# EAGLE design sound (EAGLE 9.5.2)

## Sheet 1 of 8: Interface, Address Decoding
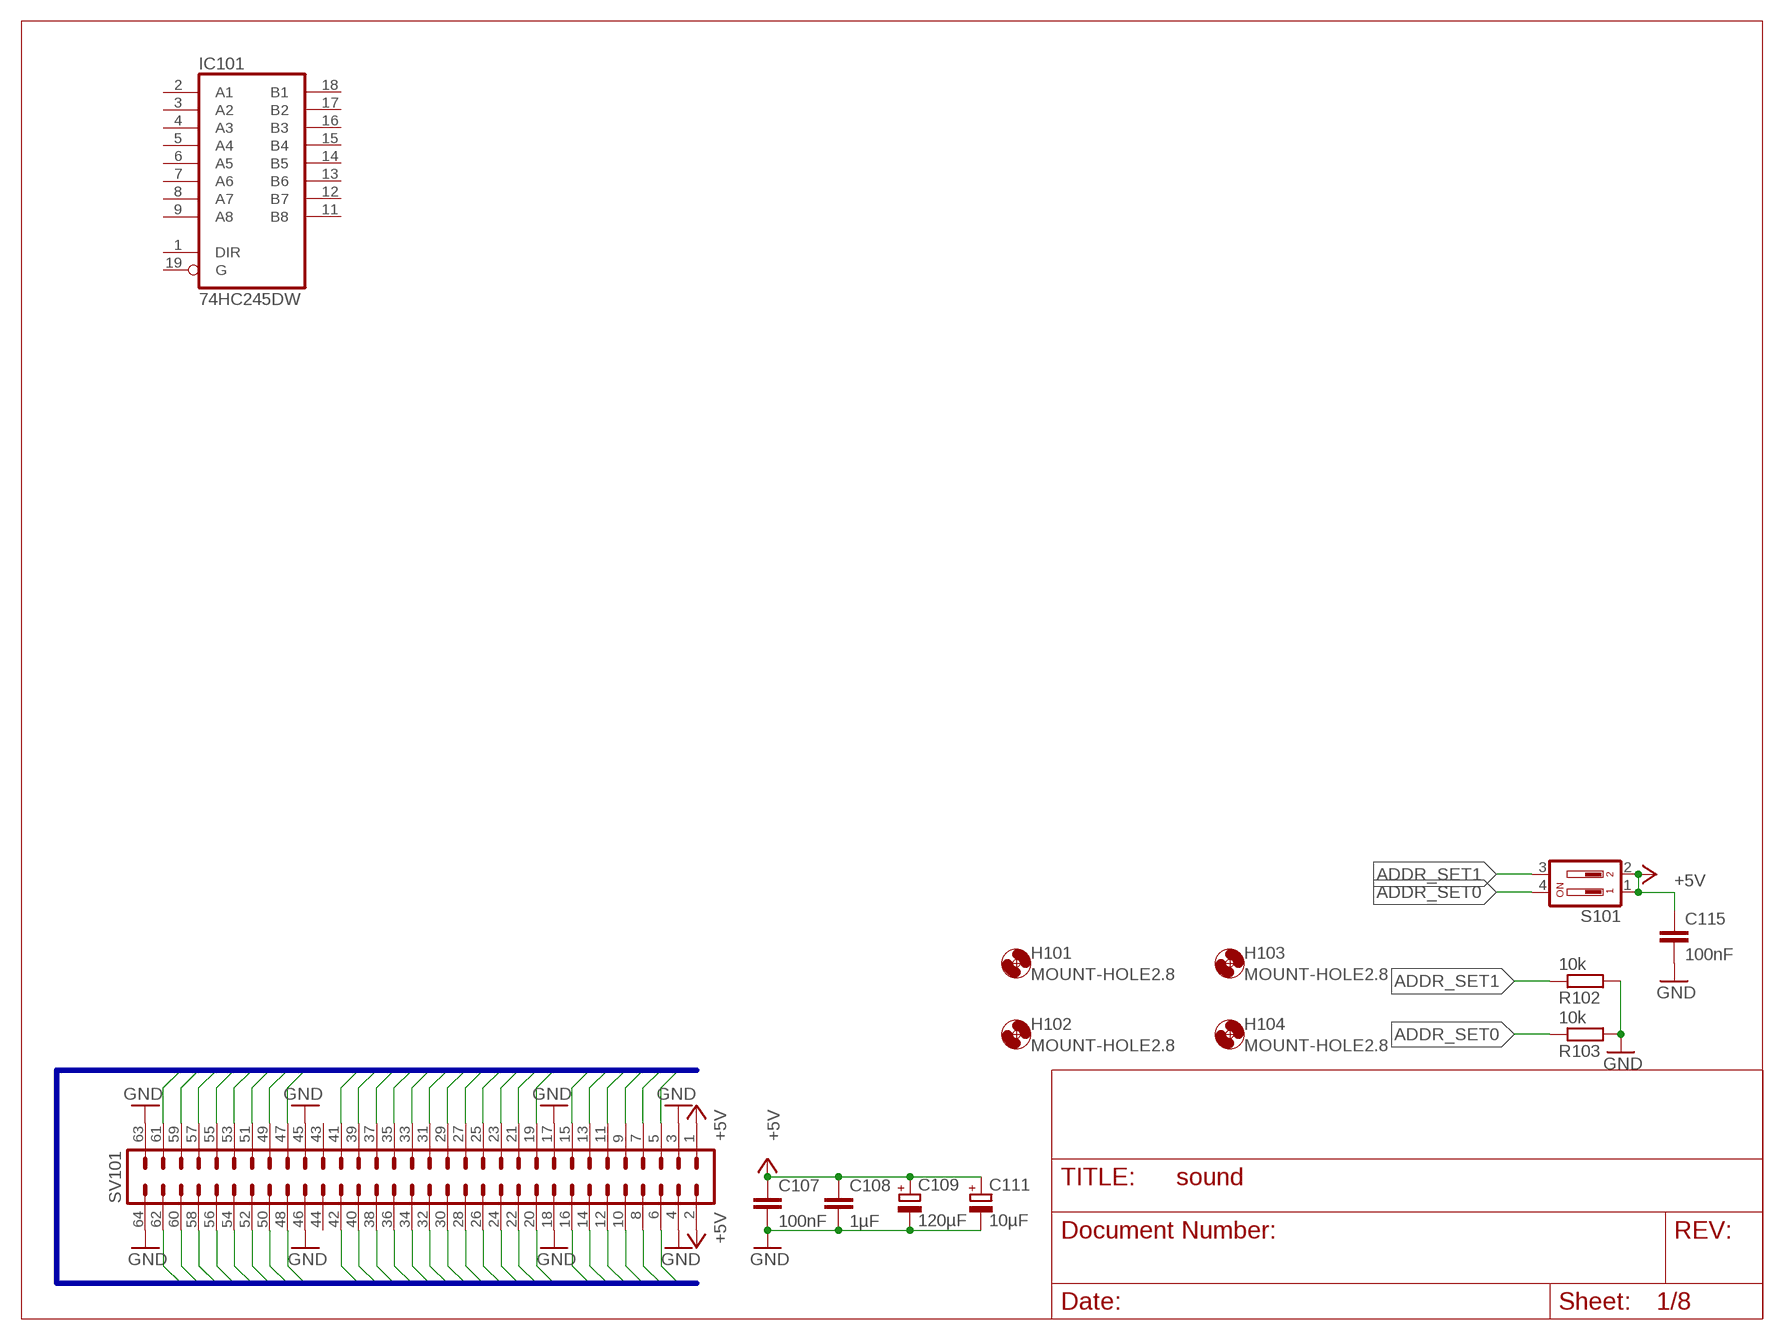
[diagram p0: schematic, sheet 1]

### Parts
C107  100nF  C-EUC0805  [C0805]
C108  1µF  C-EUC0805  [C0805]
C109  120µF  CPOL-EUE2.5-7  [E2,5-7]
C111  10µF  CPOL-EUSMCB  [SMC_B]
C115  100nF  C-EUC0805  [C0805]
H101  MOUNT-HOLE2.8  [2,8]
H102  MOUNT-HOLE2.8  [2,8]
H103  MOUNT-HOLE2.8  [2,8]
H104  MOUNT-HOLE2.8  [2,8]
IC101  74HC245DW  [SO20W]
R102  10k  R-EU_R2012  [R2012]
R103  10k  R-EU_R2012  [R2012]
S101  DP02  [DP-02]
SV101  ML64L  [ML64L]

### Nets
!AS: SV101.13
!BG: SV101.9
!BGACK: SV101.8
!BR: SV101.7
!DTACK: SV101.10
!EXT_ID: SV101.41
!EXTI_A: SV101.16
!EXTI_B: SV101.15
!HALT: SV101.5
!LDS: SV101.11
!RESET: SV101.6
!UDS: SV101.14
+5V: C107.1 C108.1 C109.+ C111.+ C115.1 S101.1 S101.2 SV101.1 SV101.2 ; also sheet 2,4,7,8
A1: SV101.20
A2: SV101.22
A3: SV101.19
A4: SV101.24
A5: SV101.21
A6: SV101.23
A7: SV101.26
A8: SV101.25
A9: SV101.28
A10: SV101.27
A11: SV101.30
A12: SV101.29
A13: SV101.31
A14: SV101.32
A15: SV101.33
A16: SV101.34
A17: SV101.36
A18: SV101.35
A19: SV101.38
A20: SV101.37
A21: SV101.40
A22: SV101.39
A23: SV101.42
ADDR_SET0: R103.1 S101.4
ADDR_SET1: R102.1 S101.3
D0: SV101.62
D1: SV101.60
D2: SV101.58
D3: SV101.56
D4: SV101.54
D5: SV101.52
D6: SV101.50
D7: SV101.48
D8: SV101.57
D9: SV101.59
D10: SV101.61
D11: SV101.55
D12: SV101.53
D13: SV101.51
D14: SV101.49
D15: SV101.47
GND: C107.2 C108.2 C109.- C111.- C115.2 R102.2 R103.2 SV101.3 SV101.4 SV101.17 SV101.18 SV101.45 SV101.46 SV101.63 SV101.64 ; also sheet 2,4,7,8
R/!W!: SV101.12
Unconnected: IC101.1(DIR) IC101.2(A1) IC101.3(A2) IC101.4(A3) IC101.5(A4) IC101.6(A5) IC101.7(A6) IC101.8(A7) IC101.9(A8) IC101.11(B8) IC101.12(B7) IC101.13(B6) IC101.14(B5) IC101.15(B4) IC101.16(B3) IC101.17(B2) IC101.18(B1) IC101.19(G) SV101.43 SV101.44

### Buses
A[1..23],!AS,!BERR,!BG,!BGACK,!BR,CLK,D[0..15],!DTACK,E,!EXTI_A,!EXTI_B,!EXT_ID,FC[0..2],!HALT,!IPL[0..2],!LDS,!RESET,R/!W!,!UDS,!VMA,!VPA

## Sheet 2 of 8: Sound CPU
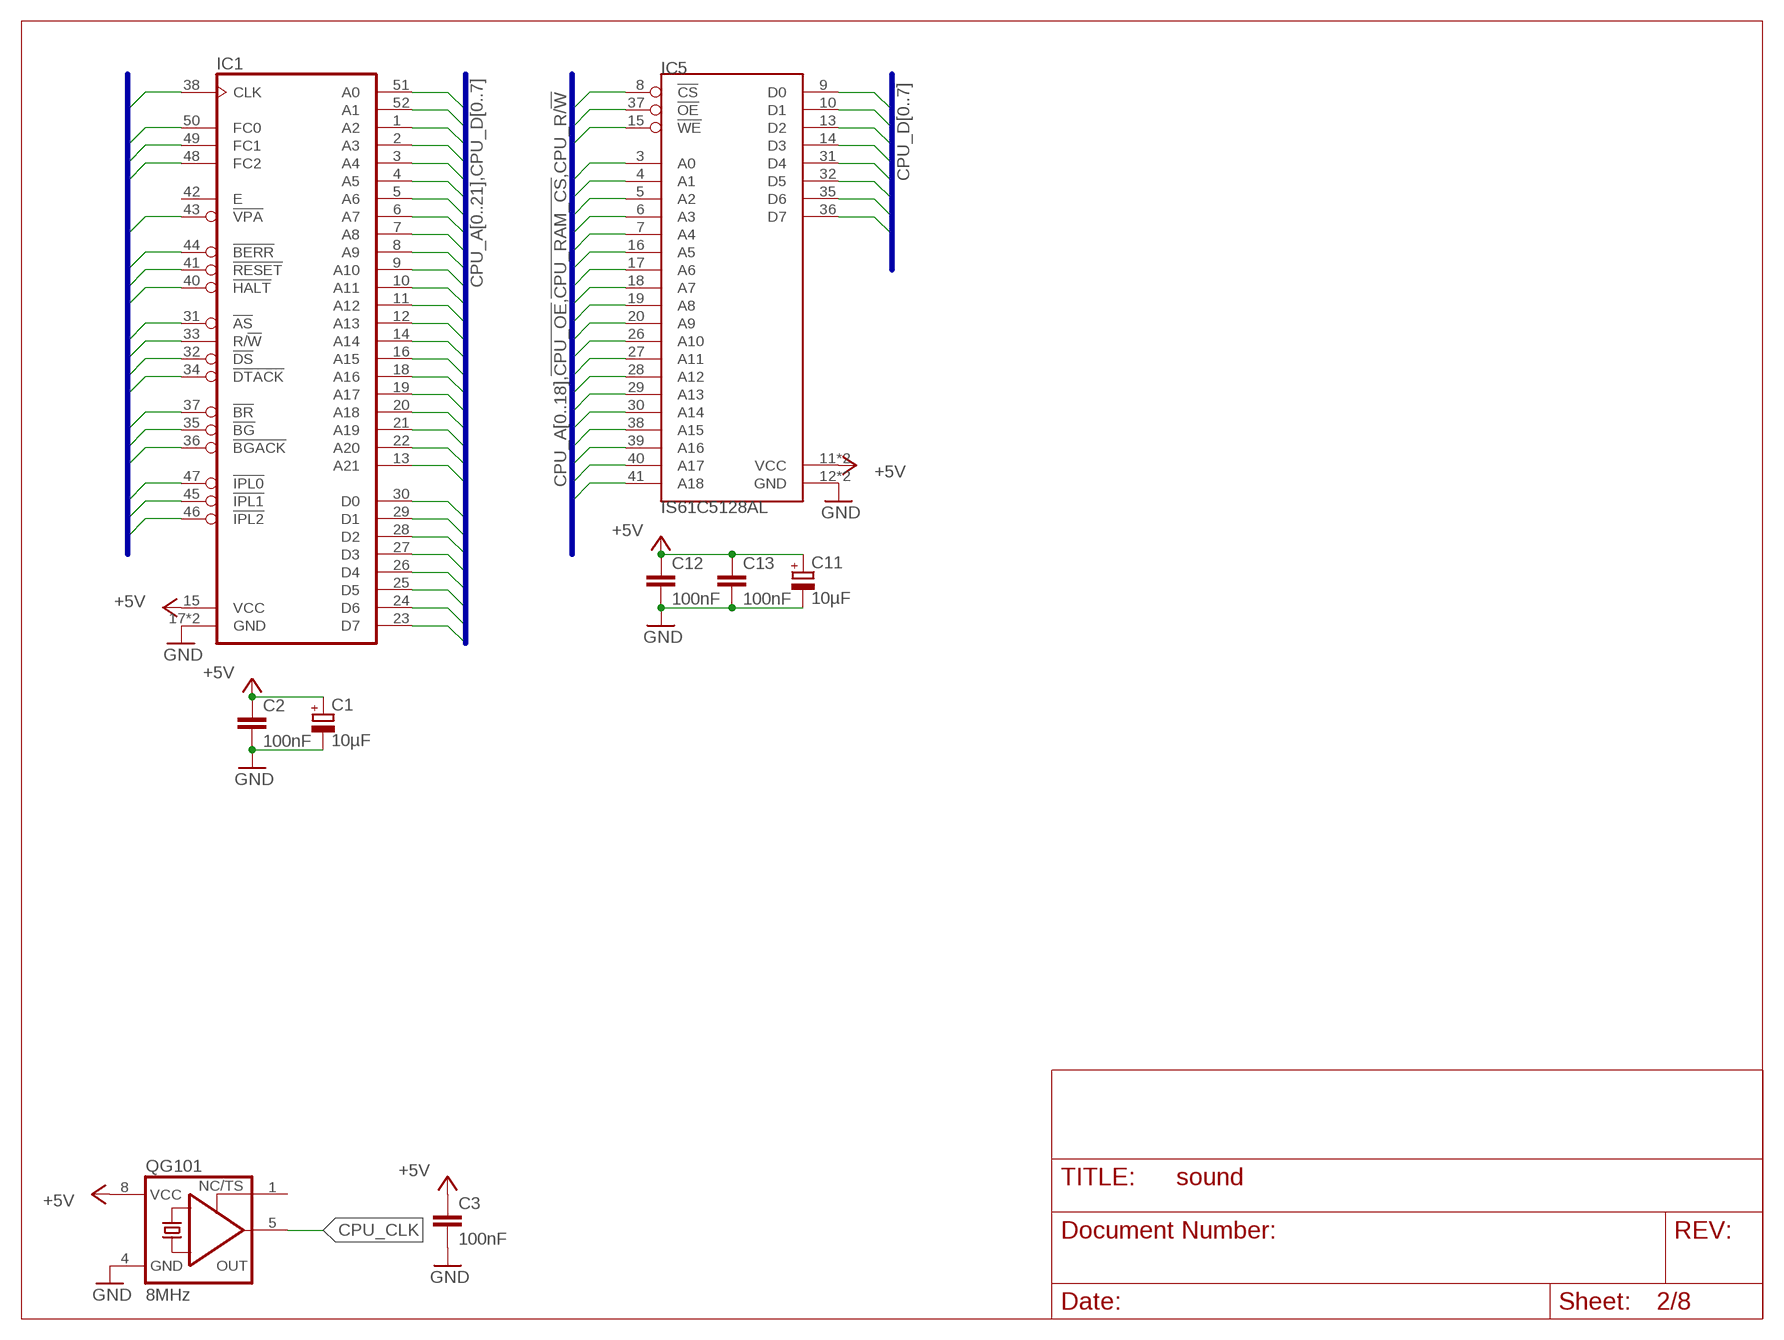
[diagram p1: schematic, sheet 2]

### Parts
C1  10µF  CPOL-EUSMCB  [SMC_B]
C2  100nF  C-EUC0805  [C0805]
C3  100nF  C-EUC0805  [C0805]
C11  10µF  CPOL-EUSMCB  [SMC_B]
C12  100nF  C-EUC0805  [C0805]
C13  100nF  C-EUC0805  [C0805]
IC1  MC68008-PLCCPLCC52-SOCKET  [PLCC52-S]
IC5  IS61C5128AL  [TSOP44-II]
QG101  8MHz  XO-8  [DIL08S]

### Nets
!CPU_AS: IC1.31(!AS)
!CPU_BERR: IC1.44(!BERR)
!CPU_BG: IC1.35(!BG) ; also sheet 8
!CPU_BGACK: IC1.36(!BGACK)
!CPU_BR: IC1.37(!BR) ; also sheet 8
!CPU_DS: IC1.32(!DS)
!CPU_DTACK: IC1.34(!DTACK)
!CPU_HALT: IC1.40(!HALT) ; also sheet 8
!CPU_IPL0: IC1.47(!IPL0)
!CPU_IPL1: IC1.45(!IPL1)
!CPU_IPL2: IC1.46(!IPL2)
!CPU_OE: IC5.37(!OE)
!CPU_RAM_CS: IC5.8(!CS)
!CPU_RESET: IC1.41(!RESET) ; also sheet 7,8
!CPU_VPA: IC1.43(!VPA)
+5V: C1.+ C2.1 C3.1 C11.+ C12.1 C13.1 IC1.15(VCC) IC5.11(VCC) IC5.33(VCC) QG101.8(VCC) ; also sheet 1,4,7,8
CPU_A0: IC1.51(A0) IC5.3(A0) ; also sheet 7
CPU_A1: IC1.52(A1) IC5.4(A1) ; also sheet 7
CPU_A2: IC1.1(A2) IC5.5(A2) ; also sheet 7
CPU_A3: IC1.2(A3) IC5.6(A3)
CPU_A4: IC1.3(A4) IC5.7(A4)
CPU_A5: IC1.4(A5) IC5.16(A5)
CPU_A6: IC1.5(A6) IC5.17(A6)
CPU_A7: IC1.6(A7) IC5.18(A7)
CPU_A8: IC1.7(A8) IC5.19(A8)
CPU_A9: IC1.8(A9) IC5.20(A9)
CPU_A10: IC1.9(A10) IC5.26(A10)
CPU_A11: IC1.10(A11) IC5.27(A11)
CPU_A12: IC1.11(A12) IC5.28(A12)
CPU_A13: IC1.12(A13) IC5.29(A13)
CPU_A14: IC1.14(A14) IC5.30(A14)
CPU_A15: IC1.16(A15) IC5.38(A15)
CPU_A16: IC1.18(A16) IC5.39(A16)
CPU_A17: IC1.19(A17) IC5.40(A17)
CPU_A18: IC1.20(A18) IC5.41(A18)
CPU_A19: IC1.21(A19)
CPU_A20: IC1.22(A20)
CPU_A21: IC1.13(A21)
CPU_CLK: IC1.38(CLK) QG101.5(OUT)
CPU_D0: IC1.30(D0) IC5.9(D0) ; also sheet 7
CPU_D1: IC1.29(D1) IC5.10(D1) ; also sheet 7
CPU_D2: IC1.28(D2) IC5.13(D2) ; also sheet 7
CPU_D3: IC1.27(D3) IC5.14(D3) ; also sheet 7
CPU_D4: IC1.26(D4) IC5.31(D4) ; also sheet 7
CPU_D5: IC1.25(D5) IC5.32(D5) ; also sheet 7
CPU_D6: IC1.24(D6) IC5.35(D6) ; also sheet 7
CPU_D7: IC1.23(D7) IC5.36(D7) ; also sheet 7
CPU_FC0: IC1.50(FC0)
CPU_FC1: IC1.49(FC1)
CPU_FC2: IC1.48(FC2)
CPU_R/!W!: IC1.33(R/!W) IC5.15(!WE) ; also sheet 7
GND: C1.- C2.2 C3.2 C11.- C12.2 C13.2 IC1.17(GND) IC1.39(GND) IC5.12(GND) IC5.34(GND) QG101.4(GND) ; also sheet 1,4,7,8
Unconnected: IC1.42(E) QG101.1(TS)

### Buses
!CPU_AS,!CPU_BERR,!CPU_BG,!CPU_BGACK,!CPU_BR,CPU_CLK,!CPU_DS,!CPU_DTACK,CPU_FC[0..2],!CPU_HALT,!CPU_IPL[0..2],!CPU_RESET,CPU_R/!W!,!CPU_VPA
CPU_A[0..21],CPU_D[0..7]
CPU_A[0..18],!CPU_OE,!CPU_RAM_CS,CPU_R/!W!
CPU_D[0..7]

## Sheet 3 of 8: Sound CPU Logic
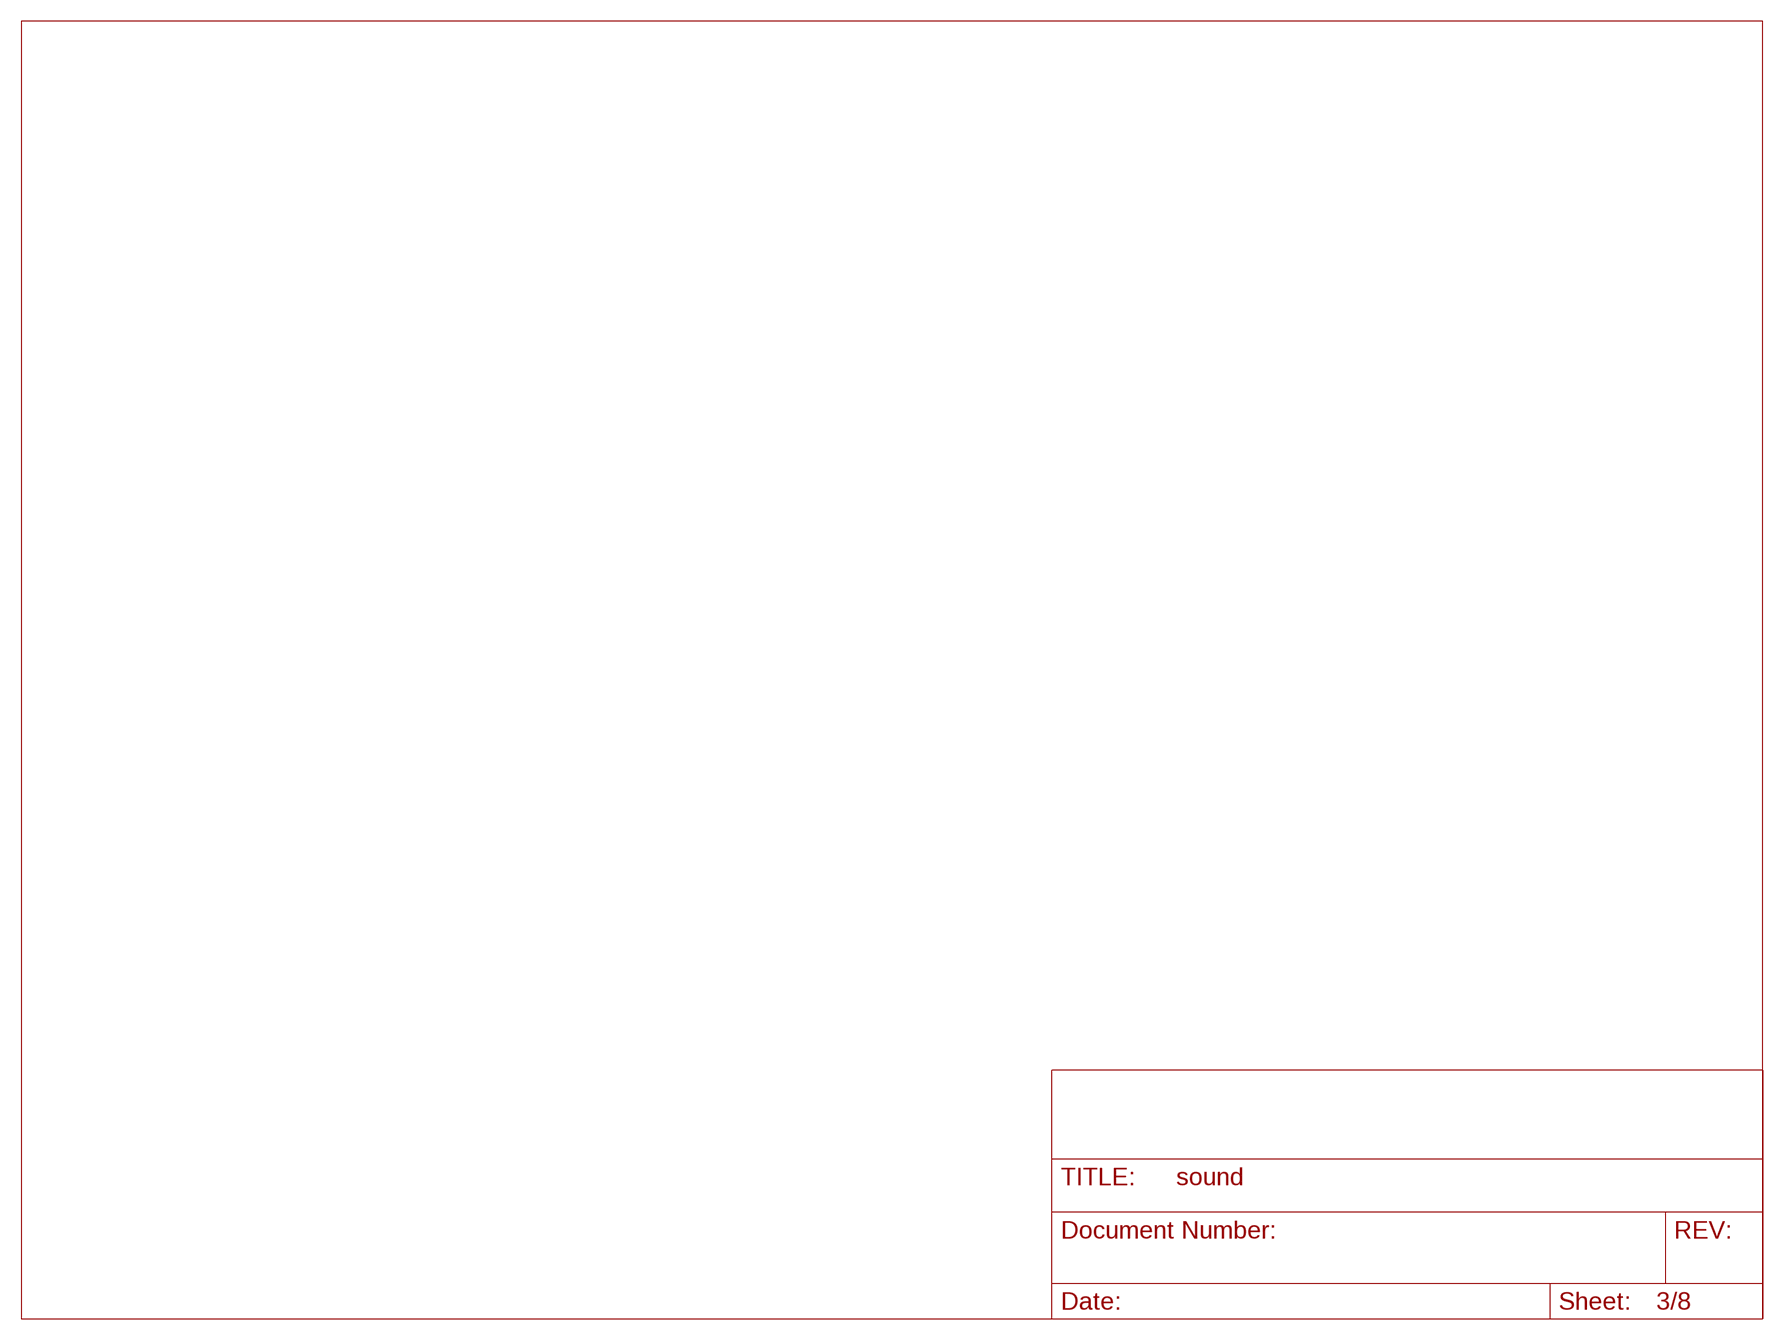
[diagram p2: schematic, sheet 3]

## Sheet 4 of 8: Sound CPU / Host IF
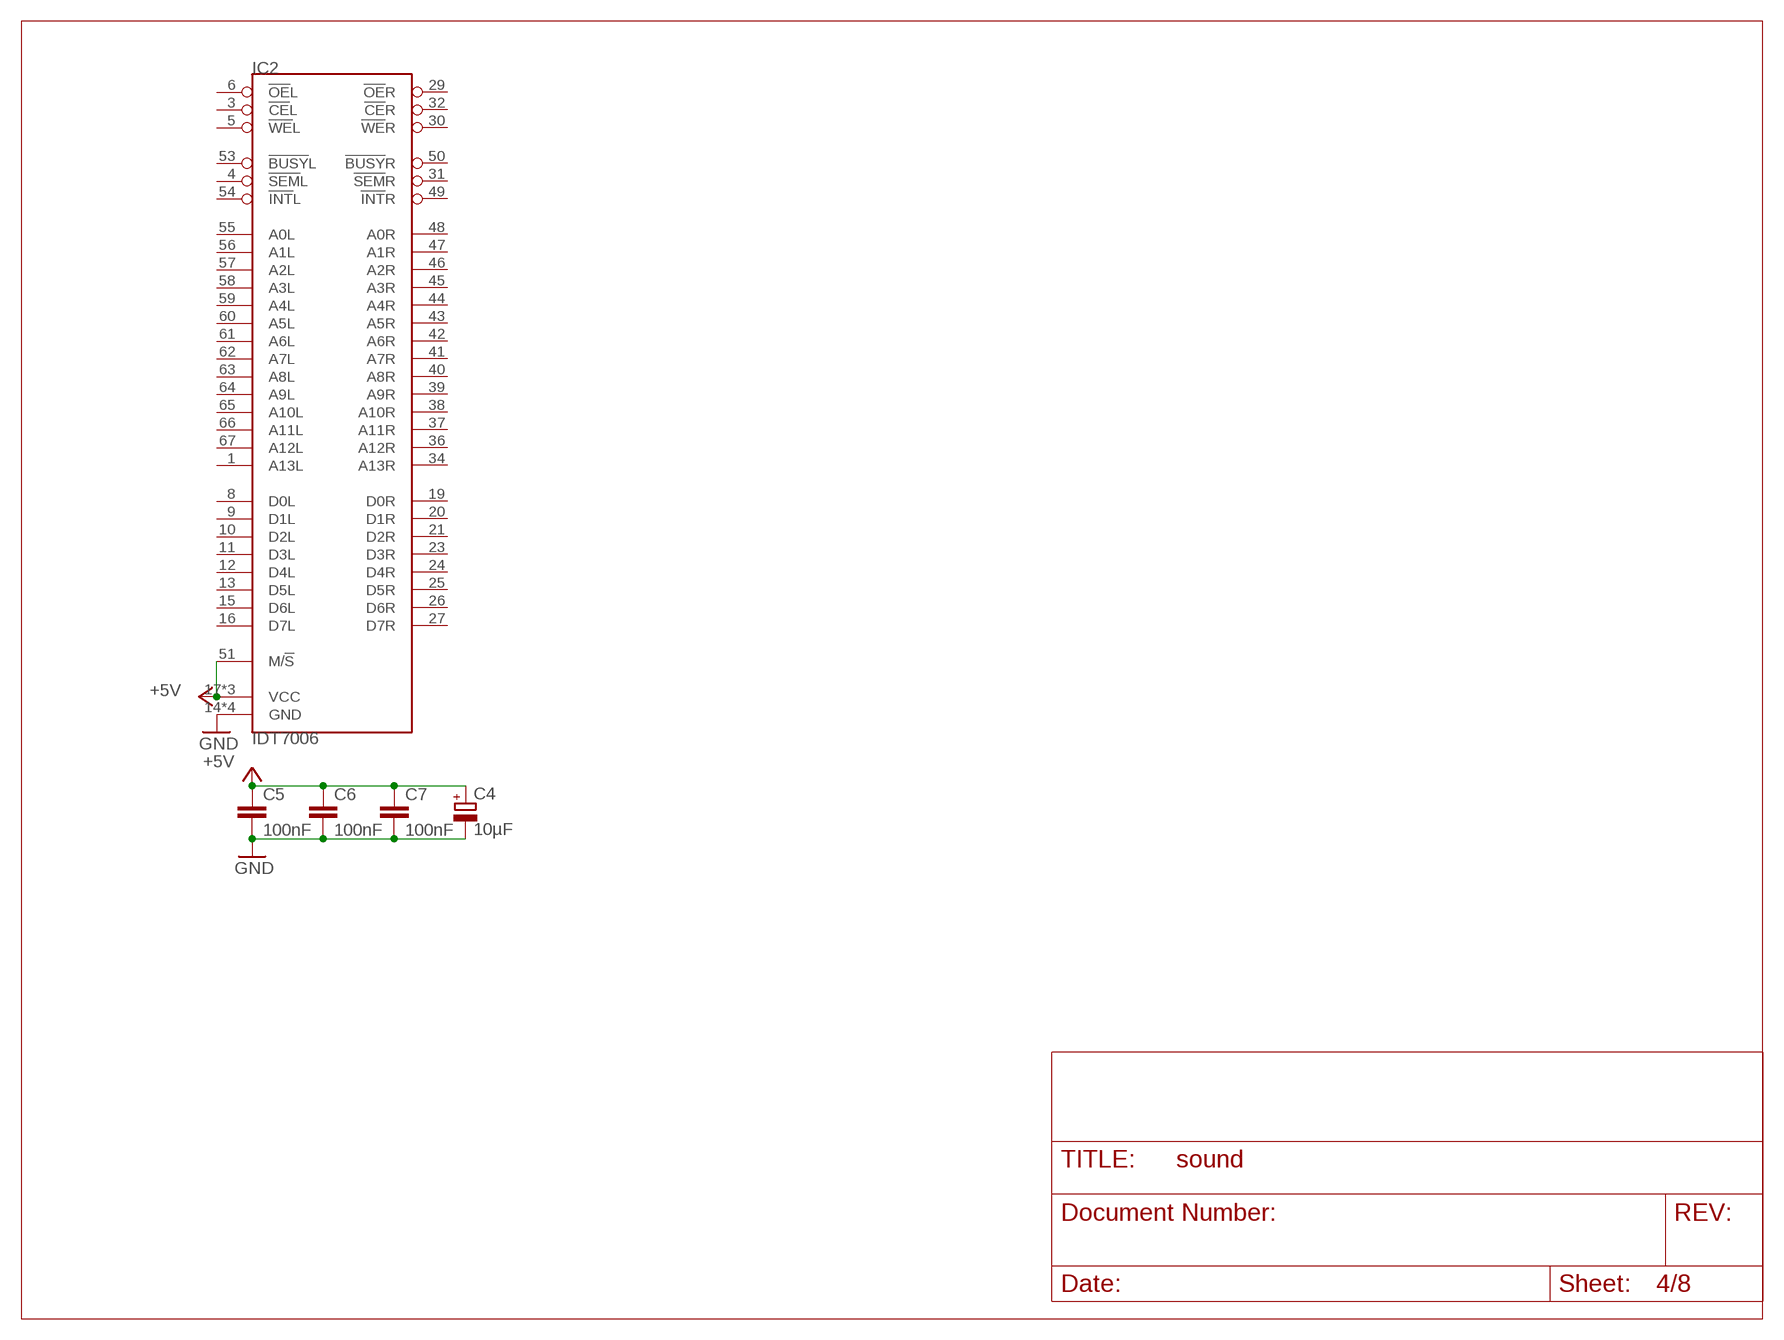
[diagram p3: schematic, sheet 4]

### Parts
C4  10µF  CPOL-EUSMCB  [SMC_B]
C5  100nF  C-EUC0805  [C0805]
C6  100nF  C-EUC0805  [C0805]
C7  100nF  C-EUC0805  [C0805]
IC2  IDT7006  IDT7006PLCC68-S  [PLCC68-S]

### Nets
+5V: C4.+ C5.1 C6.1 C7.1 IC2.17(VCC) IC2.22(VCC) IC2.51(M/!S!) IC2.68(VCC) ; also sheet 1,2,7,8
GND: C4.- C5.2 C6.2 C7.2 IC2.14(GND) IC2.18(GND) IC2.35(GND) IC2.52(GND) ; also sheet 1,2,7,8
Unconnected: IC2.1(A13L) IC2.3(!CE!L) IC2.4(!SEM!L) IC2.5(!WE!L) IC2.6(!OE!L) IC2.8(D0L) IC2.9(D1L) IC2.10(D2L) IC2.11(D3L) IC2.12(D4L) IC2.13(D5L) IC2.15(D6L) IC2.16(D7L) IC2.19(D0R) IC2.20(D1R) IC2.21(D2R) IC2.23(D3R) IC2.24(D4R) IC2.25(D5R) IC2.26(D6R) IC2.27(D7R) IC2.29(!OE!R) IC2.30(!WE!R) IC2.31(!SEM!R) IC2.32(!CE!R) IC2.34(A13R) IC2.36(A12R) IC2.37(A11R) IC2.38(A10R) IC2.39(A9R) IC2.40(A8R) IC2.41(A7R) IC2.42(A6R) IC2.43(A5R) IC2.44(A4R) IC2.45(A3R) IC2.46(A2R) IC2.47(A1R) IC2.48(A0R) IC2.49(!INT!R) IC2.50(!BUSY!R) IC2.53(!BUSY!L) IC2.54(!INT!L) IC2.55(A0L) IC2.56(A1L) IC2.57(A2L) IC2.58(A3L) IC2.59(A4L) IC2.60(A5L) IC2.61(A6L) IC2.62(A7L) IC2.63(A8L) IC2.64(A9L) IC2.65(A10L) IC2.66(A11L) IC2.67(A12L)

## Sheet 5 of 8: YM3812 / YM2149
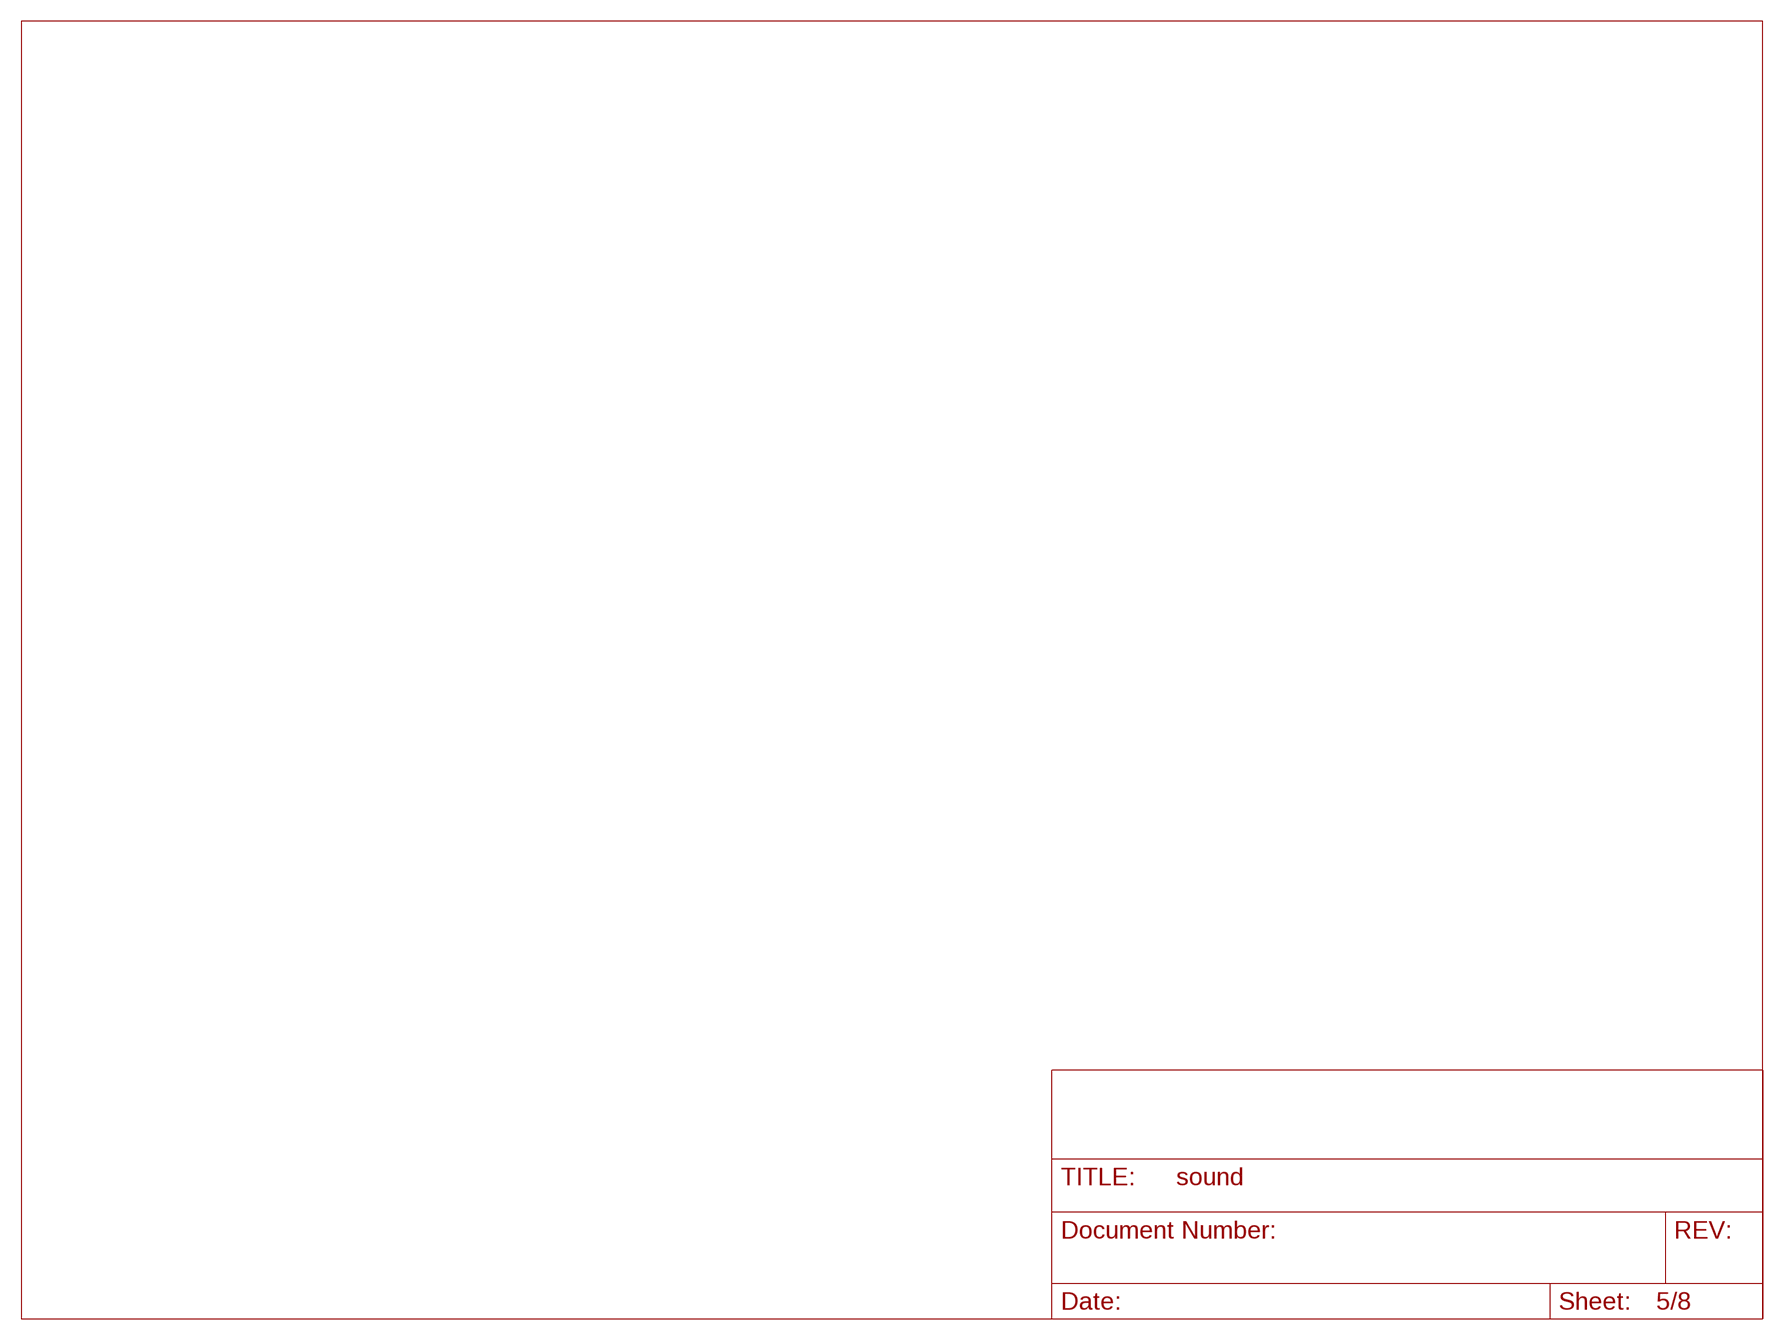
[diagram p4: schematic, sheet 5]

## Sheet 6 of 8: Audio Mixing
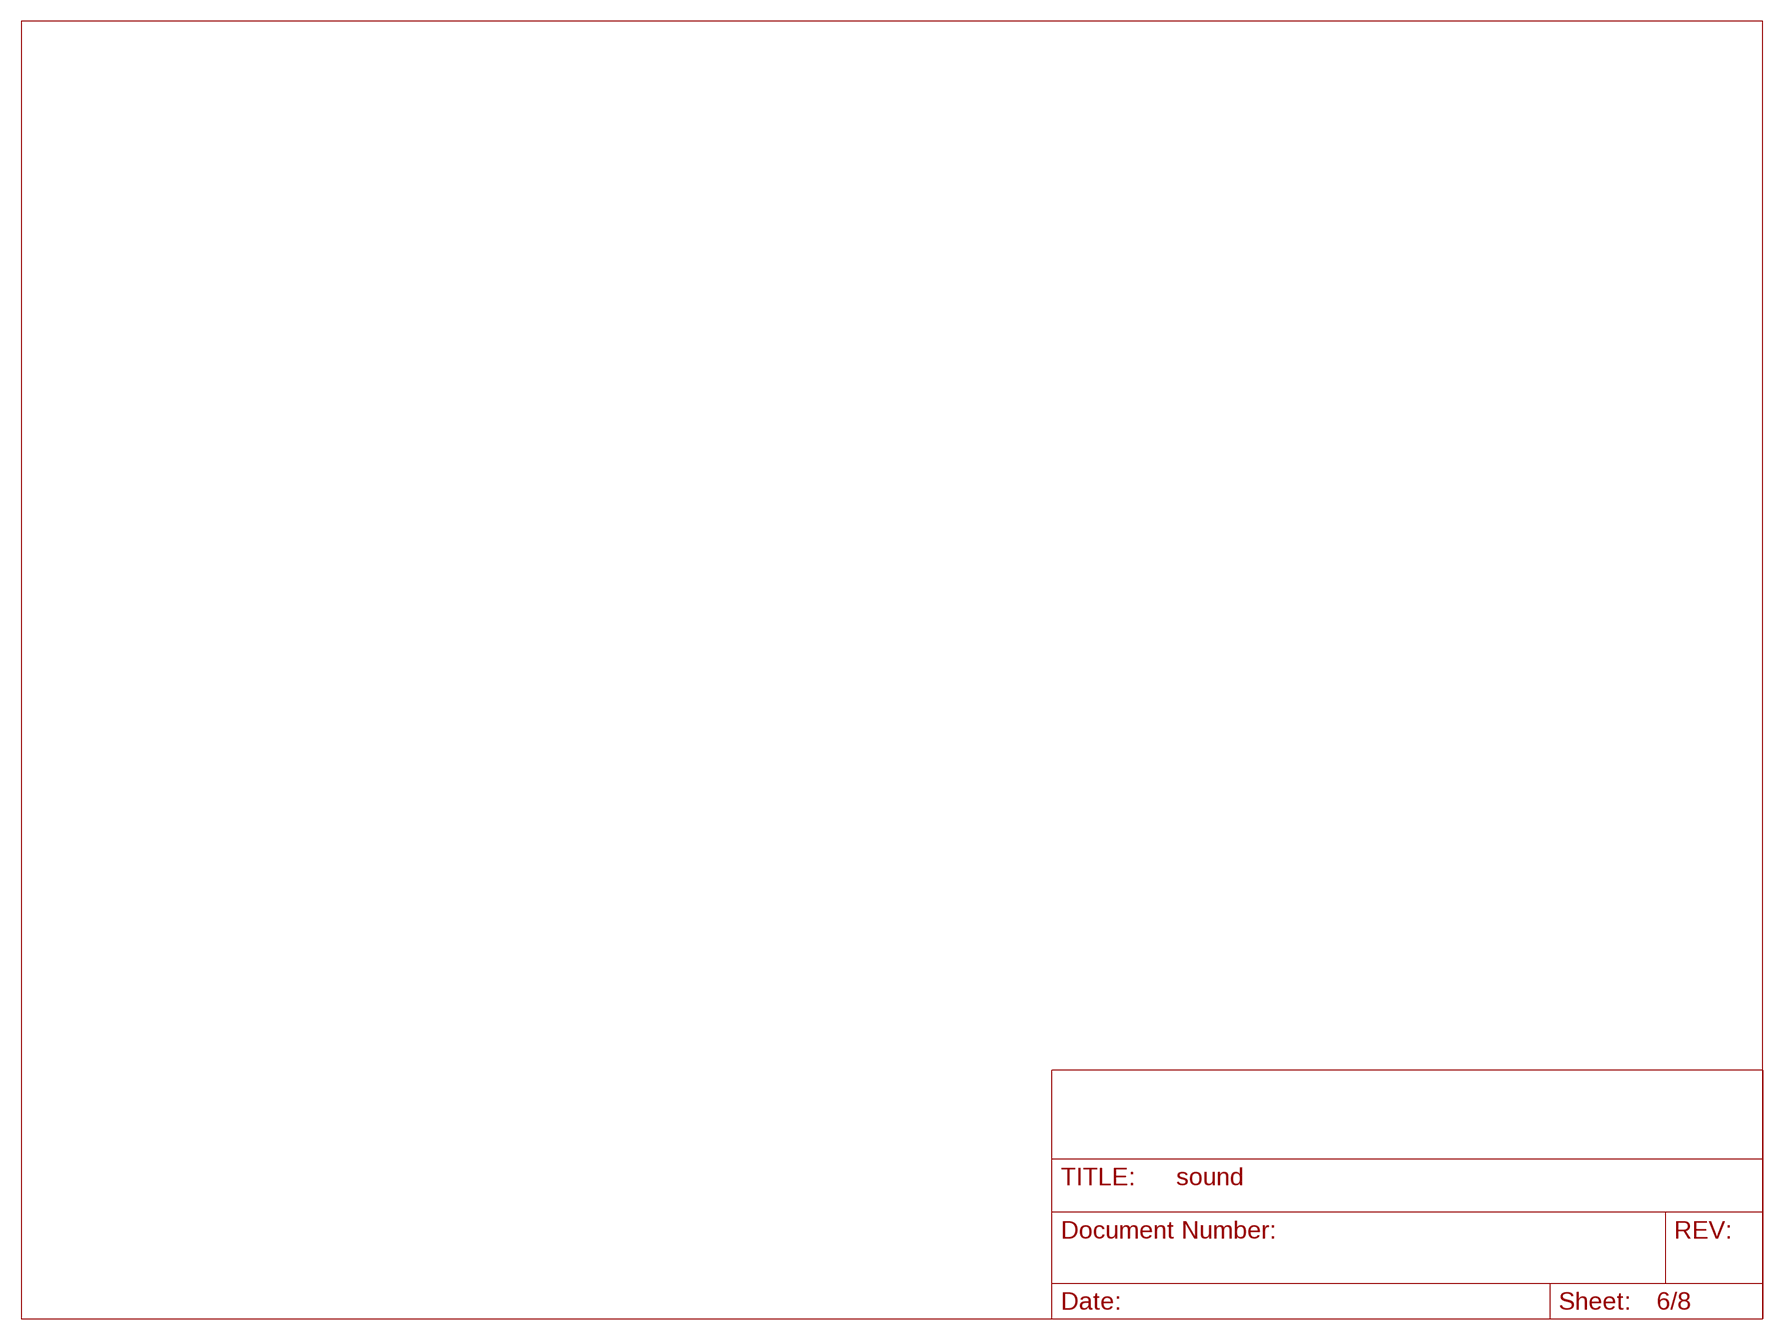
[diagram p5: schematic, sheet 6]

## Sheet 7 of 8: MIDI IF
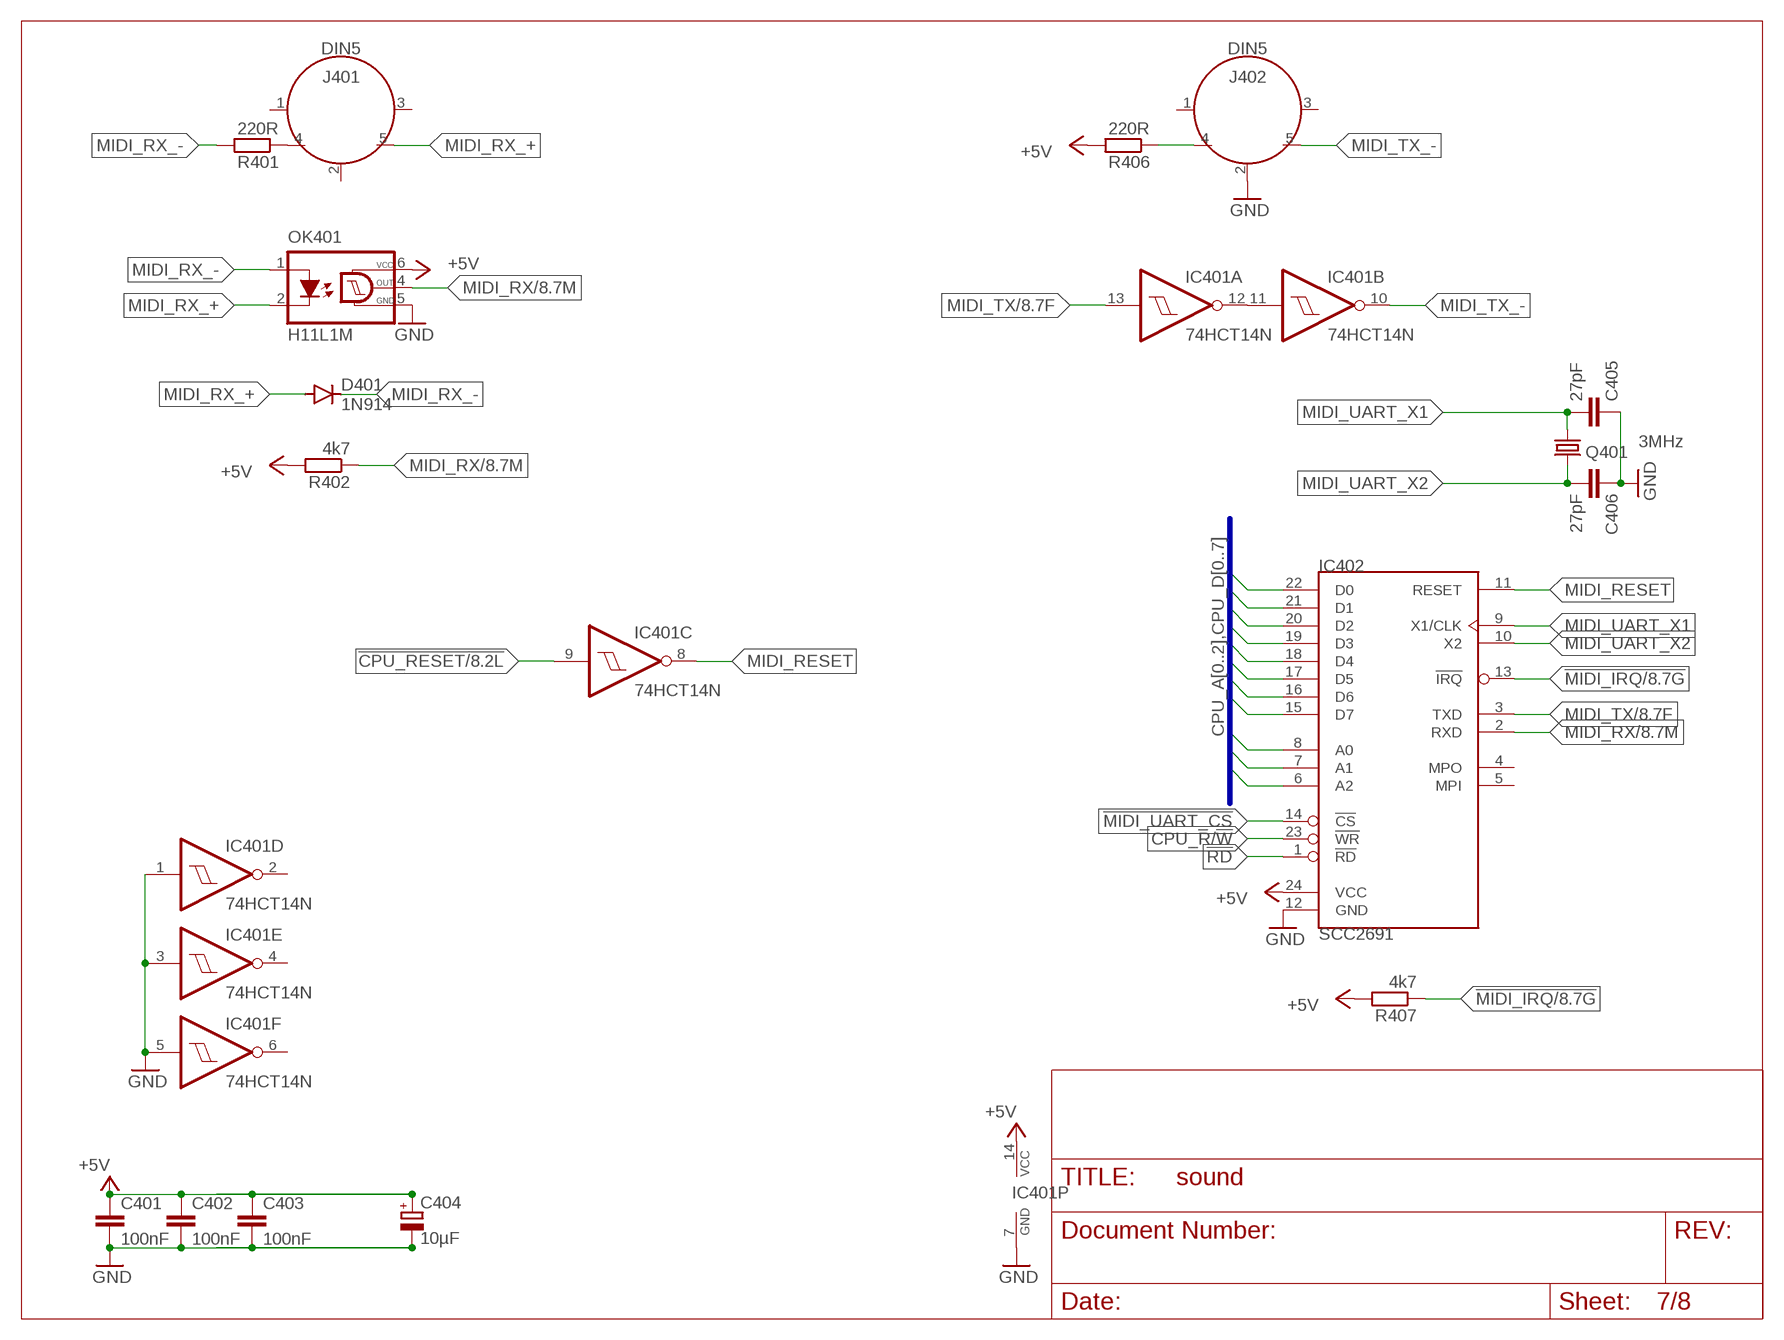
[diagram p6: schematic, sheet 7]

### Parts
C401  100nF  C-EUC0805  [C0805]
C402  100nF  C-EUC0805  [C0805]
C403  100nF  C-EUC0805  [C0805]
C404  10µF  CPOL-EUSMCB  [SMC_B]
C405  27pF  C-EUC0805  [C0805]
C406  27pF  C-EUC0805  [C0805]
D401  1N914  1N4148DO35-10  [DO35-10]
IC401  74HCT14N  [DIL14]
IC402  SCC2691  [DIL24S]
J401  DIN5  [DIN5-RA-PTH]
J402  DIN5  [DIN5-RA-PTH]
OK401  H11L1M  [DIL06]
Q401  3MHz  CRYSTALHC49S  [HC49/S]
R401  220R  R-EU_R2012  [R2012]
R402  4k7  R-EU_R2012  [R2012]
R406  220R  R-EU_R2012  [R2012]
R407  4k7  R-EU_R2012  [R2012]

### Nets
!CPU_RESET: IC401.9(C:I) ; also sheet 2,8
!MIDI_IRQ: IC402.13(!IRQ) R407.1 ; also sheet 8
!MIDI_UART_CS: IC402.14(!CS)
!RD: IC402.1(!RD)
+5V: C401.1 C402.1 C403.1 C404.+ IC401.14(P:VCC) IC402.24(VCC) OK401.6(VCC) R402.2 R406.2 R407.2 ; also sheet 1,2,4,8
CPU_A0: IC402.8(A0) ; also sheet 2
CPU_A1: IC402.7(A1) ; also sheet 2
CPU_A2: IC402.6(A2) ; also sheet 2
CPU_D0: IC402.22(D0) ; also sheet 2
CPU_D1: IC402.21(D1) ; also sheet 2
CPU_D2: IC402.20(D2) ; also sheet 2
CPU_D3: IC402.19(D3) ; also sheet 2
CPU_D4: IC402.18(D4) ; also sheet 2
CPU_D5: IC402.17(D5) ; also sheet 2
CPU_D6: IC402.16(D6) ; also sheet 2
CPU_D7: IC402.15(D7) ; also sheet 2
CPU_R/!W!: IC402.23(!WR) ; also sheet 2
GND: C401.2 C402.2 C403.2 C404.- C405.1 C406.1 IC401.1(D:I) IC401.3(E:I) IC401.5(F:I) IC401.7(P:GND) IC402.12(GND) J402.2 OK401.5(GND) ; also sheet 1,2,4,8
MIDI_RESET: IC401.8(C:O) IC402.11(RESET)
MIDI_RX: IC402.2(RXD) OK401.4(OUT) R402.1 ; also sheet 8
MIDI_RX_+: D401.A J401.5 OK401.2(C)
MIDI_RX_-: D401.C OK401.1(A) R401.2
MIDI_TX: IC401.13(A:I) IC402.3(TXD) ; also sheet 8
MIDI_TX_-: IC401.10(B:O) J402.5
MIDI_UART_X1: C405.2 IC402.9(X1/CLK) Q401.1
MIDI_UART_X2: C406.2 IC402.10(X2) Q401.2
N$14: J401.4 R401.1
N$16: IC401.11(B:I) IC401.12(A:O)
N$17: J402.4 R406.1
Unconnected: IC401.2(D:O) IC401.4(E:O) IC401.6(F:O) IC402.4(MPO) IC402.5(MPI) J401.1 J401.2 J401.3 J402.1 J402.3

### Buses
CPU_A[0..2],CPU_D[0..7]

## Sheet 8 of 8: Blinkenlights
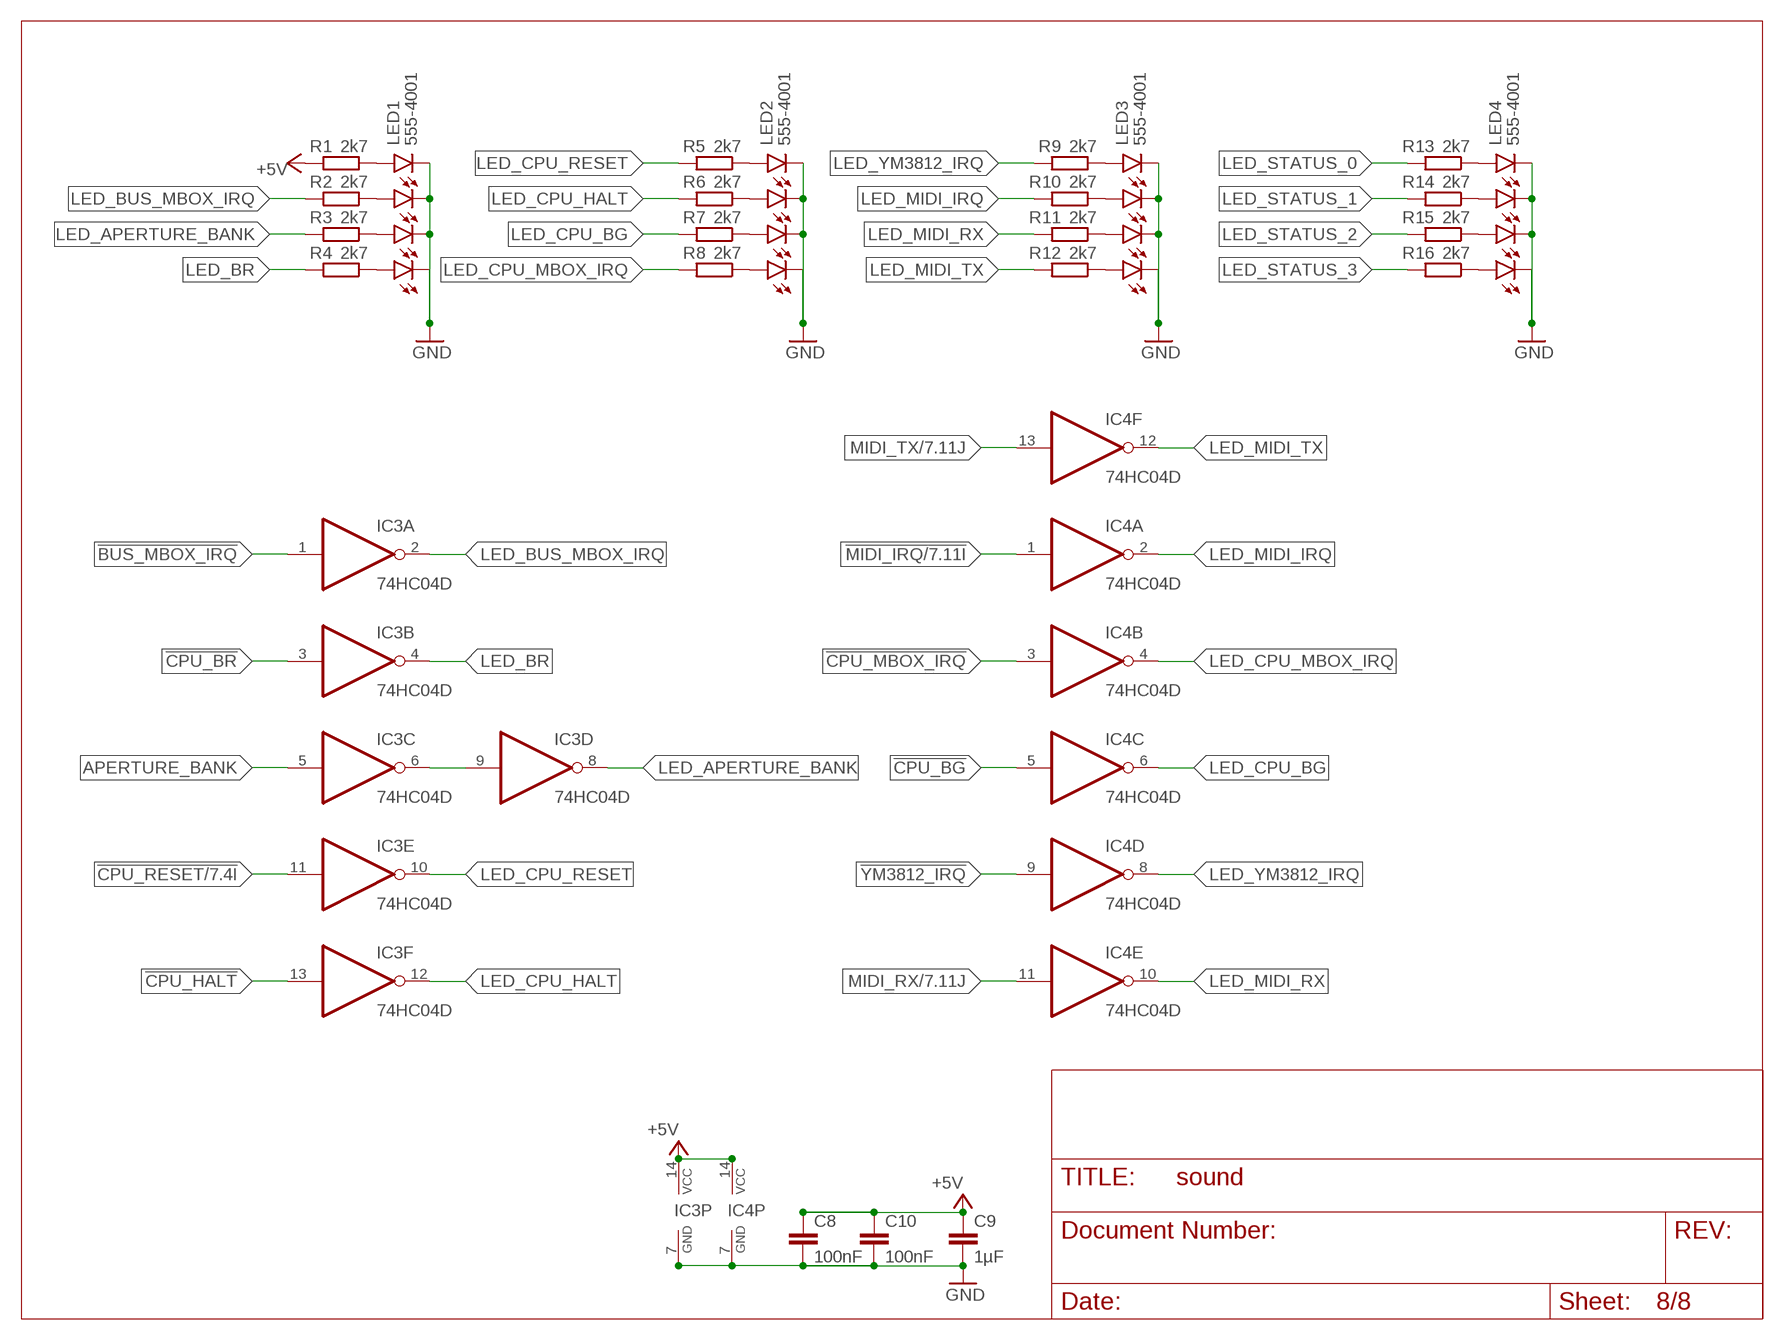
[diagram p7: schematic, sheet 8]

### Parts
C8  100nF  C-EUC0805  [C0805]
C9  1µF  C-EUC0805  [C0805]
C10  100nF  C-EUC0805  [C0805]
IC3  74HC04D  [SO14]
IC4  74HC04D  [SO14]
LED1  555-4001  [555-4001]
LED2  555-4001  [555-4001]
LED3  555-4001  [555-4001]
LED4  555-4001  [555-4001]
R1  2k7  R-EU_R2012  [R2012]
R2  2k7  R-EU_R2012  [R2012]
R3  2k7  R-EU_R2012  [R2012]
R4  2k7  R-EU_R2012  [R2012]
R5  2k7  R-EU_R2012  [R2012]
R6  2k7  R-EU_R2012  [R2012]
R7  2k7  R-EU_R2012  [R2012]
R8  2k7  R-EU_R2012  [R2012]
R9  2k7  R-EU_R2012  [R2012]
R10  2k7  R-EU_R2012  [R2012]
R11  2k7  R-EU_R2012  [R2012]
R12  2k7  R-EU_R2012  [R2012]
R13  2k7  R-EU_R2012  [R2012]
R14  2k7  R-EU_R2012  [R2012]
R15  2k7  R-EU_R2012  [R2012]
R16  2k7  R-EU_R2012  [R2012]

### Nets
!BUS_MBOX_IRQ: IC3.1(A:I)
!CPU_BG: IC4.5(C:I) ; also sheet 2
!CPU_BR: IC3.3(B:I) ; also sheet 2
!CPU_HALT: IC3.13(F:I) ; also sheet 2
!CPU_MBOX_IRQ: IC4.3(B:I)
!CPU_RESET: IC3.11(E:I) ; also sheet 2,7
!MIDI_IRQ: IC4.1(A:I) ; also sheet 7
!YM3812_IRQ: IC4.9(D:I)
+5V: C8.1 C9.1 C10.1 IC3.14(P:VCC) IC4.14(P:VCC) R1.2 ; also sheet 1,2,4,7
APERTURE_BANK: IC3.5(C:I)
GND: C8.2 C9.2 C10.2 IC3.7(P:GND) IC4.7(P:GND) LED1.K1 LED1.K2 LED1.K3 LED1.K4 LED2.K1 LED2.K2 LED2.K3 LED2.K4 LED3.K1 LED3.K2 LED3.K3 LED3.K4 LED4.K1 LED4.K2 LED4.K3 LED4.K4 ; also sheet 1,2,4,7
LED_APERTURE_BANK: IC3.8(D:O) R3.2
LED_BR: IC3.4(B:O) R4.2
LED_BUS_MBOX_IRQ: IC3.2(A:O) R2.2
LED_CPU_BG: IC4.6(C:O) R7.2
LED_CPU_HALT: IC3.12(F:O) R6.2
LED_CPU_MBOX_IRQ: IC4.4(B:O) R8.2
LED_CPU_RESET: IC3.10(E:O) R5.2
LED_MIDI_IRQ: IC4.2(A:O) R10.2
LED_MIDI_RX: IC4.10(E:O) R11.2
LED_MIDI_TX: IC4.12(F:O) R12.2
LED_STATUS_0: R13.2
LED_STATUS_1: R14.2
LED_STATUS_2: R15.2
LED_STATUS_3: R16.2
LED_YM3812_IRQ: IC4.8(D:O) R9.2
MIDI_RX: IC4.11(E:I) ; also sheet 7
MIDI_TX: IC4.13(F:I) ; also sheet 7
N$2: LED1.A4 R1.1
N$4: LED1.A3 R2.1
N$5: LED1.A2 R3.1
N$6: LED1.A1 R4.1
N$7: LED2.A4 R5.1
N$9: LED2.A3 R6.1
N$10: IC3.6(C:O) IC3.9(D:I)
N$11: LED2.A2 R7.1
N$12: LED2.A1 R8.1
N$13: LED3.A4 R9.1
N$15: LED3.A3 R10.1
N$19: LED3.A2 R11.1
N$20: LED3.A1 R12.1
N$21: LED4.A4 R13.1
N$22: LED4.A3 R14.1
N$23: LED4.A2 R15.1
N$24: LED4.A1 R16.1

## Power pins joined to a net without a drawn wire
GND: IC101.10(GND)
VCC: IC101.20(VCC)

## Library data of the parts
C1 C4 C11 C111 C404 = rcl:CPOL-EU: POLARIZED CAPACITOR, European symbol; MOUSER: 581-TAJB106K020RNJV; SPICEPREFIX: C
C2 C3 C5-C8 C10 C12 C13 C107 C115 C401-C403 = rcl:C-EU: CAPACITOR, European symbol; MOUSER: 710-885012207072; SPICEPREFIX: C
C9 C108 = rcl:C-EU: CAPACITOR, European symbol; MOUSER: 710-885012207078; SPICEPREFIX: C
C109 = rcl:CPOL-EU: POLARIZED CAPACITOR, European symbol; MOUSER: 710-860020373007; SPICEPREFIX: C
C405 C406 = rcl:C-EU: CAPACITOR, European symbol; MOUSER: 80-C0805C270K5HACTU; SPICEPREFIX: C
D401 = diode:1N4148: DIODE high speed (Philips); MOUSER: 512-1N914TR
H101-H104 = holes:MOUNT-HOLE: MOUNTING HOLE with drill center marker
IC1 = 68komputer:MC68008-PLCC: 68008 Processor (68000 with 8-bit bus) 52 pin PLCC package (4MB address space)
IC2 = 68komputer:IDT7006: IDT7006 – 16K x 8 Dual Port SRAM For master operation, tie M/S to VCC. Datasheet <https://www.idt.com/document/dst/7006-data-sheet>
IC3 IC4 = 74xx-eu:74*04: Hex INVERTER
IC5 = 68komputer:IS61C5128AL: IS61C5128AL – 512K x 8 SRAM (10ns) Datasheet <https://www.mouser.com/datasheet/2/198/61-64C5128AL-258414.pdf>; MOUSER: 870-61C5128AL-10TLI
IC101 = 74xx-eu:74*245: Octal BUS TRANSCEIVER, 3-state; MOUSER: 595-SN74HC245DWR
IC401 = 74xx-eu:74*14: Hex schmitt trigger INVERTER; MOUSER: 595-SN74HCT14N; MOUSER_SOCKET: 575-1104731441001000
IC402 = 68komputer:SCC2691: SCC2691 – Universal asynchronous receiver/transmitter (UART) Datasheet <https://www.nxp.com/docs/en/data-sheet/SCC2691.pdf>; MOUSER_SOCKET: 575-11044324
J401 J402 = SparkFun-Connectors:DIN5: DIN5 Connector - Female Right Angle (frequently used as a MIDI Jack connector) This type of connector and cable is frequently used for transmitting midi data (musical instrument digital interface). It is what you usually see on a keyboard or set of electronic drums. Learn more here <https://en.wikipedia.org/wiki/MIDI>. For more information on the pinout and electrical specifications of MIDI communications, please see the following resource: https://www.midi.org/specifications/item/midi-din-electrical-specification Here is the connector we sell at SparkFun: MIDI Connector - Female Right Angle <https://www.sparkfun.com/products/9536> (PRT-09536) Datasheet <hhttp://www.sparkfun.com/datasheets/Prototyping/Connectors/MIDI-RA.pdf> It is used on this SparkFun product: SparkFun MIDI Shield <https://www.sparkfun.com/products/12898> (DEV-12898); MOUSER: 806-KCDX-5S-N; PROD_ID: CONN-09481
LED1-LED4 = 68komputer:555-4001: Dialight 555-4001 LED Array 4x Red LED Datasheet <https://linearparts.com/documents/Dialight-555-4001.pdf>
OK401 = optocoupler:H11L*M: 6-Pin DIP Optocoupler Source: http://www.fairchildsemi.com/ds/H1/H11L2-M.pdf; MF: FAIRCHILD SEMICONDUCTOR; MOUSER: 512-H11L1M; MOUSER_SOCKET: 575-1104730641001000; MPN: H11L1-M; OC_FARNELL: 1021127; OC_NEWARK: 72K8643
Q401 = crystal:CRYSTAL: CRYSTAL; MOUSER: 520-HCA300-SX; OC_FARNELL: 1667008; OC_NEWARK: unknown
QG101 = crystal:XO-: CRYSTAL; MOUSER: 774-MXO45HS-3C-8.0; MOUSER_SOCKET: 535-1108800; OC_FARNELL: unknown; OC_NEWARK: unknown
R1-R16 = rcl:R-EU_: RESISTOR, European symbol; MOUSER: 652-CR0805FX-2701ELF; SPICEPREFIX: R
R102 R103 = rcl:R-EU_: RESISTOR, European symbol; MOUSER: 652-CR0805FX-1002ELF; SPICEPREFIX: R
R401 R406 = rcl:R-EU_: RESISTOR, European symbol; MOUSER: 652-CR0805FX-2200ELF; SPICEPREFIX: R
R402 R407 = rcl:R-EU_: RESISTOR, European symbol; MOUSER: 652-CR0805FX-4701ELF; SPICEPREFIX: R
S101 = switch-dil:DP02: DIL/CODE SWITCH; MPN: MCDP02; OC_FARNELL: 1255233; OC_NEWARK: 26M1095
SV101 = con-harting-ml:ML64: HARTING; OC_FARNELL: unknown; OC_NEWARK: unknown

## Net classes
0 default: width 0.203 mm

## Board
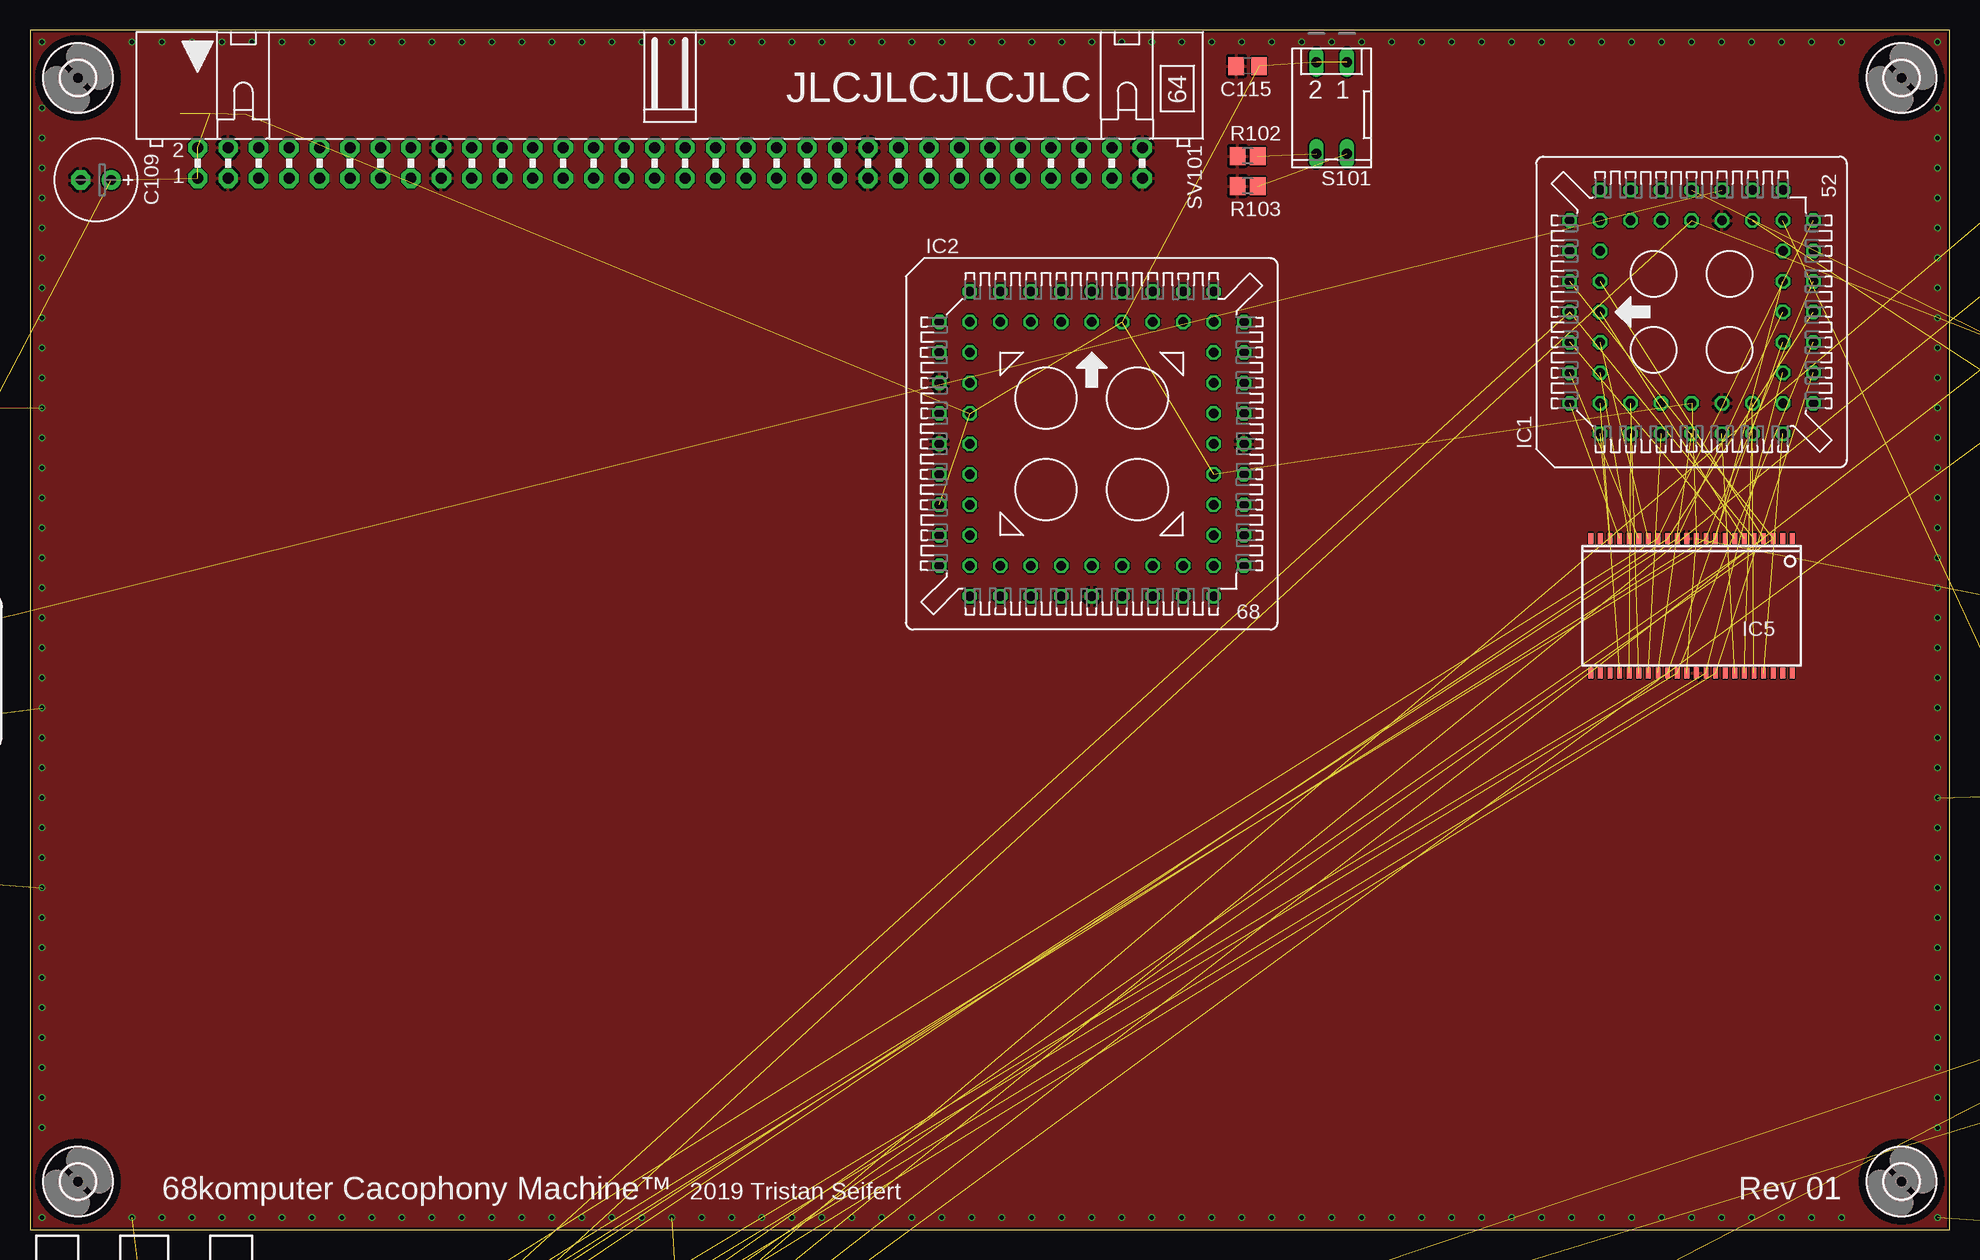
[diagram p8: board, top side]
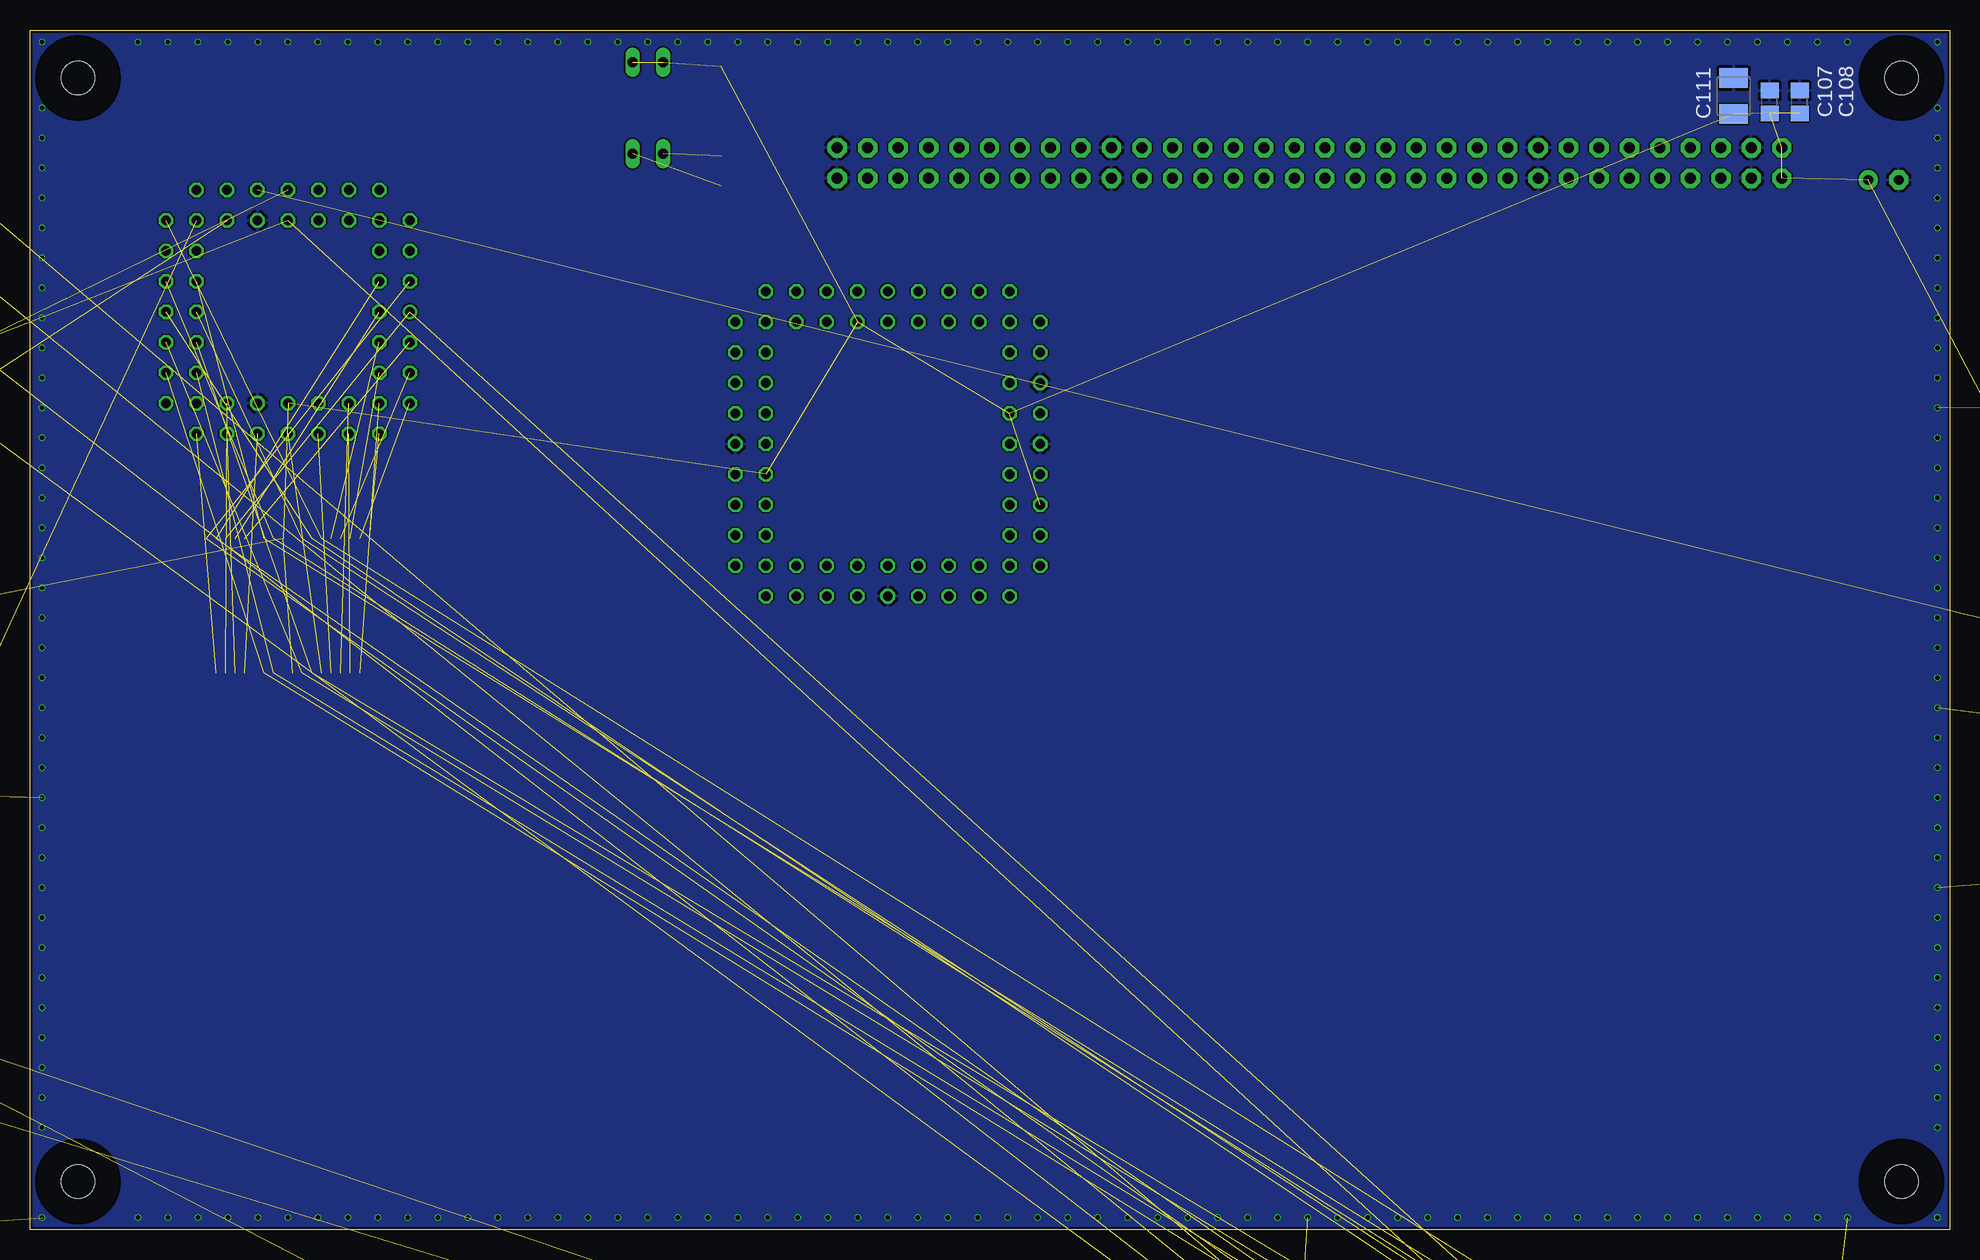
[diagram p9: board, bottom side, seen from below]

Size 160 x 100 mm. Coordinates in mm from the lower left corner, seen from the top.
Outline: 0,0 160,0 160,100 0,100 0,0
Copper layers (1*16): Top 0.035559375mm / dielectric 1.6mm / Bottom 0.035559375mm
Design rules "jlcpcb2layer": minimum track width 5mil, minimum drill 12mil, track to track 5mil, track to pad 5mil, pad to pad 5mil, via to via 5mil, smd to smd 5mil, copper to edge 8mil, drill to drill 6mil, minimum pad ring 5mil, minimum via ring 3mil, stop-mask expansion 2.5mil, vias tented up to drill 0mil, thermal gap 10mil

### Footprints (pad centres in the part's own frame; a part is rotated, then mirrored left to right if it is on the bottom)
SMC_B = smd 1.6 x 2.4: + -1.5,0; - 1.5,0
C0805 = smd 1.3 x 1.5: 1 -0.95,0; 2 0.95,0
E2,5-7 = drill 0.813 pad 1.6: + -1.27,0 | drill 0.813 pad 1.6 octagon: - 1.27,0
DO35-10 = drill 0.813 long: A 5.08,0; C -5.08,0
2,8 = hole 2.8: 0,0
PLCC52-S = drill 0.813: 1 0,10.16 | drill 0.813 octagon: 2 0,7.62; 3 -2.54,10.16; 4 -2.54,7.62; 5 -5.08,10.16; 6 -5.08,7.62; 7 -7.62,10.16; 8 -10.16,7.62; 9 -7.62,7.62; 10 -10.16,5.08; 11 -7.62,5.08; 12 -10.16,2.54; 13 -7.62,2.54; 14 -10.16,0; 15 -7.62,0; 16 -10.16,-2.54; 17 -7.62,-2.54; 18 -10.16,-5.08; 19 -7.62,-5.08; 20 -10.16,-7.62; 21 -7.62,-10.16; 22 -7.62,-7.62; 23 -5.08,-10.16; 24 -5.08,-7.62; 25 -2.54,-10.16; 26 -2.54,-7.62; 27 0,-10.16; 28 0,-7.62; 29 2.54,-10.16; 30 2.54,-7.62; 31 5.08,-10.16; 32 5.08,-7.62; 33 7.62,-10.16; 34 10.16,-7.62; 35 7.62,-7.62; 36 10.16,-5.08; 37 7.62,-5.08; 38 10.16,-2.54; 39 7.62,-2.54; 40 10.16,0; 41 7.62,0; 42 10.16,2.54; 43 7.62,2.54; 44 7.62,5.08; 45 10.16,5.08; 46 10.16,7.62; 47 7.62,10.16; 48 7.62,7.62; 49 5.08,10.16; 50 5.08,7.62; 51 2.54,10.16; 52 2.54,7.62
PLCC68-S = drill 0.813: 1 0,12.7 | drill 0.813 octagon: 2 0,10.16; 3 -2.54,12.7; 4 -2.54,10.16; 5 -5.08,12.7; 6 -5.08,10.16; 7 -7.62,12.7; 8 -7.62,10.16; 9 -10.16,12.7; 10 -12.7,10.16; 11 -10.16,10.16; 12 -12.7,7.62; 13 -10.16,7.62; 14 -12.7,5.08; 15 -10.16,5.08; 16 -12.7,2.54; 17 -10.16,2.54; 18 -12.7,0; 19 -10.16,0; 20 -12.7,-2.54; 21 -10.16,-2.54; 22 -12.7,-5.08; 23 -10.16,-5.08; 24 -12.7,-7.62; 25 -10.16,-7.62; 26 -12.7,-10.16; 27 -10.16,-12.7; 28 -10.16,-10.16; 29 -7.62,-12.7; 30 -7.62,-10.16; 31 -5.08,-12.7; 32 -5.08,-10.16; 33 -2.54,-12.7; 34 -2.54,-10.16; 35 0,-12.7; 36 0,-10.16; 37 2.54,-12.7; 38 2.54,-10.16; 39 5.08,-12.7; 40 5.08,-10.16; 41 7.62,-12.7; 42 7.62,-10.16; 43 10.16,-12.7; 44 12.7,-10.16; 45 10.16,-10.16; 46 12.7,-7.62; 47 10.16,-7.62; 48 12.7,-5.08; 49 10.16,-5.08; 50 12.7,-2.54; 51 10.16,-2.54; 52 12.7,0; 53 10.16,0; 54 12.7,2.54; 55 10.16,2.54; 56 12.7,5.08; 57 10.16,5.08; 58 12.7,7.62; 59 10.16,7.62; 60 12.7,10.16; 61 10.16,12.7; 62 10.16,10.16; 63 7.62,12.7; 64 7.62,10.16; 65 5.08,12.7; 66 5.08,10.16; 67 2.54,12.7; 68 2.54,10.16
SO14 = smd 0.66 x 2.032: 1 -3.81,-3.073; 2 -2.54,-3.073; 3 -1.27,-3.073; 4 0,-3.073; 5 1.27,-3.073; 6 2.54,-3.073; 7 3.81,-3.073; 8 3.81,3.073; 9 2.54,3.073; 10 1.27,3.073; 11 0,3.073; 12 -1.27,3.073; 13 -2.54,3.073; 14 -3.81,3.073
TSOP44-II = smd 0.4 x 0.9: 1 -8.4,-5.6; 2 -7.6,-5.6; 3 -6.8,-5.6; 4 -6,-5.6; 5 -5.2,-5.6; 6 -4.4,-5.6; 7 -3.6,-5.6; 8 -2.8,-5.6; 9 -2,-5.6; 10 -1.2,-5.6; 11 -0.4,-5.6; 12 0.4,-5.6; 13 1.2,-5.6; 14 2,-5.6; 15 2.8,-5.6; 16 3.6,-5.6; 17 4.4,-5.6; 18 5.2,-5.6; 19 6,-5.6; 20 6.8,-5.6; 21 7.6,-5.6; 22 8.4,-5.6; 23 8.4,5.6; 24 7.6,5.6; 25 6.8,5.6; 26 6,5.6; 27 5.2,5.6; 28 4.4,5.6; 29 3.6,5.6; 30 2.8,5.6; 31 2,5.6; 32 1.2,5.6; 33 0.4,5.6; 34 -0.4,5.6; 35 -1.2,5.6; 36 -2,5.6; 37 -2.8,5.6; 38 -3.6,5.6; 39 -4.4,5.6; 40 -5.2,5.6; 41 -6,5.6; 42 -6.8,5.6; 43 -7.6,5.6; 44 -8.4,5.6
SO20W = smd 0.66 x 2.032: 1 -5.715,-5.029; 2 -4.445,-5.029; 3 -3.175,-5.029; 4 -1.905,-5.029; 5 -0.635,-5.029; 6 0.635,-5.029; 7 1.905,-5.029; 8 3.175,-5.029; 9 4.445,-5.029; 10 5.715,-5.029; 11 5.715,5.029; 12 4.445,5.029; 13 3.175,5.029; 14 1.905,5.029; 15 0.635,5.029; 16 -0.635,5.029; 17 -1.905,5.029; 18 -3.175,5.029; 19 -4.445,5.029; 20 -5.715,5.029
DIL14 = drill 0.813 long: 1 -7.62,-3.81; 2 -5.08,-3.81; 3 -2.54,-3.81; 4 0,-3.81; 5 2.54,-3.81; 6 5.08,-3.81; 7 7.62,-3.81; 8 7.62,3.81; 9 5.08,3.81; 10 2.54,3.81; 11 0,3.81; 12 -2.54,3.81; 13 -5.08,3.81; 14 -7.62,3.81
DIL24S = drill 0.813 long: 1 -13.97,-3.81; 2 -11.43,-3.81; 3 -8.89,-3.81; 4 -6.35,-3.81; 5 -3.81,-3.81; 6 -1.27,-3.81; 7 1.27,-3.81; 8 3.81,-3.81; 9 6.35,-3.81; 10 8.89,-3.81; 11 11.43,-3.81; 12 13.97,-3.81; 13 13.97,3.81; 14 11.43,3.81; 15 8.89,3.81; 16 6.35,3.81; 17 3.81,3.81; 18 1.27,3.81; 19 -1.27,3.81; 20 -3.81,3.81; 21 -6.35,3.81; 22 -8.89,3.81; 23 -11.43,3.81; 24 -13.97,3.81
DIN5-RA-PTH = drill 1.4 pad 2.286: 1 7.3,12.5; 2 0,12.5; 3 -7.3,12.5; 4 5,15; 5 -5,15; 6 -5,2.8; 7 5,2.8
555-4001 = drill 0.686: A1 1.35,-1.02; A2 3.89,-1.02; A3 6.43,-1.02; A4 8.97,-1.02; K1 1.35,-3.56; K2 3.89,-3.56; K3 6.43,-3.56; K4 8.97,-3.56
DIL06 = drill 0.813 offset: 1 -2.54,-3.81; 2 0,-3.81; 3 2.54,-3.81; 4 2.54,3.81; 5 0,3.81; 6 -2.54,3.81
HC49/S = drill 0.813: 1 -2.413,0; 2 2.413,0
DIL08S = drill 0.813: 1 -3.81,-3.81; 4 3.81,-3.81; 5 3.81,3.81; 8 -3.81,3.81
R2012 = smd 1.3 x 1.5: 1 -0.85,0; 2 0.85,0
DP-02 = drill 0.813 long: 1 -1.27,-3.81; 2 1.27,-3.81; 3 1.27,3.81; 4 -1.27,3.81
ML64L = drill 0.914 pad 1.6 octagon: 1 -39.37,-1.27; 2 -39.37,1.27; 3 -36.83,-1.27; 4 -36.83,1.27; 5 -34.29,-1.27; 6 -34.29,1.27; 7 -31.75,-1.27; 8 -31.75,1.27; 9 -29.21,-1.27; 10 -29.21,1.27; 11 -26.67,-1.27; 12 -26.67,1.27; 13 -24.13,-1.27; 14 -24.13,1.27; 15 -21.59,-1.27; 16 -21.59,1.27; 17 -19.05,-1.27; 18 -19.05,1.27; 19 -16.51,-1.27; 20 -16.51,1.27; 21 -13.97,-1.27; 22 -13.97,1.27; 23 -11.43,-1.27; 24 -11.43,1.27; 25 -8.89,-1.27; 26 -8.89,1.27; 27 -6.35,-1.27; 28 -6.35,1.27; 29 -3.81,-1.27; 30 -3.81,1.27; 31 -1.27,-1.27; 32 -1.27,1.27; 33 1.27,-1.27; 34 1.27,1.27; 35 3.81,-1.27; 36 3.81,1.27; 37 6.35,-1.27; 38 6.35,1.27; 39 8.89,-1.27; 40 8.89,1.27; 41 11.43,-1.27; 42 11.43,1.27; 43 13.97,-1.27; 44 13.97,1.27; 45 16.51,-1.27; 46 16.51,1.27; 47 19.05,-1.27; 48 19.05,1.27; 49 21.59,-1.27; 50 21.59,1.27; 51 24.13,-1.27; 52 24.13,1.27; 53 26.67,-1.27; 54 26.67,1.27; 55 29.21,-1.27; 56 29.21,1.27; 57 31.75,-1.27; 58 31.75,1.27; 59 34.29,-1.27; 60 34.29,1.27; 61 36.83,-1.27; 62 36.83,1.27; 63 39.37,-1.27; 64 39.37,1.27

### Placement (x,y rotation side)
C1  -19,30 0 top  (outside the outline)
C2  -14.5,30.5 0 top  (outside the outline)
C3  -19.5,23.5 0 top  (outside the outline)
C4  -7,29 0 top  (outside the outline)
C5  -7.5,22.5 0 top  (outside the outline)
C6  -7.5,16 0 top  (outside the outline)
C7  -7.5,9.5 0 top  (outside the outline)
C8  178.5,58 0 top  (outside the outline)
C9  173.5,8 0 top  (outside the outline)
C10  173.5,51 0 top  (outside the outline)
C11  -20,-84.5 0 top  (outside the outline)
C12  -20.5,-91 0 top  (outside the outline)
C13  -20.5,-97.5 0 top  (outside the outline)
C107  15,94 90 bottom
C108  12.5,94 90 bottom
C109  5.5,87.5 180 top
C111  18,94.5 90 bottom
C115  101.5,97 180 top
C401  -7.5,-61 0 top  (outside the outline)
C402  -1,-61 0 top  (outside the outline)
C403  5.5,-61 0 top  (outside the outline)
C404  25,-51 0 top  (outside the outline)
C405  3.5,-67.5 0 top  (outside the outline)
C406  9,-67.5 0 top  (outside the outline)
D401  -16,-61 0 top  (outside the outline)
H101  4,96 0 top
H102  4,4 0 top
H103  156,96 0 top
H104  156,4 0 top
IC1  138.5,76.5 90 top
IC2  88.5,65.5 0 top
IC3  178,65.5 0 top  (outside the outline)
IC4  178,15.5 0 top  (outside the outline)
IC5  138.5,52 180 top
IC101  -15.5,63.5 180 top  (outside the outline)
IC401  -11.5,-52.5 0 top  (outside the outline)
IC402  -5.5,-42 0 top  (outside the outline)
J401  -12,-19.5 0 top  (outside the outline)
J402  9.5,-19.5 0 top  (outside the outline)
LED1  60.5,-11.5 180 top  (outside the outline)
LED2  172.5,40 0 top  (outside the outline)
LED3  172.5,3.5 0 top  (outside the outline)
LED4  172.5,-18 0 top  (outside the outline)
OK401  -16.5,-31 0 top  (outside the outline)
Q401  3.5,-52 0 top  (outside the outline)
QG101  -9,46.5 0 top  (outside the outline)
R1  173.5,92.5 0 top  (outside the outline)
R2  173.5,86 0 top  (outside the outline)
R3  173.5,79.5 0 top  (outside the outline)
R4  173.5,73 0 top  (outside the outline)
R5  173.5,29.5 0 top  (outside the outline)
R6  178.5,29.5 0 top  (outside the outline)
R7  183.5,29.5 0 top  (outside the outline)
R8  173.5,23 0 top  (outside the outline)
R9  173.5,-13.5 0 top  (outside the outline)
R10  173.5,-7 0 top  (outside the outline)
R11  178.5,-7 0 top  (outside the outline)
R12  183.5,-7 0 top  (outside the outline)
R13  173.5,-28.5 0 top  (outside the outline)
R14  178.5,-28.5 0 top  (outside the outline)
R15  183.5,-28.5 0 top  (outside the outline)
R16  173.5,-35 0 top  (outside the outline)
R102  101.5,89.5 180 top
R103  101.5,87 180 top
R401  12,-61 0 top  (outside the outline)
R402  25,-61 0 top  (outside the outline)
R406  18.5,-61 0 top  (outside the outline)
R407  -2.5,-67.5 0 top  (outside the outline)
S101  108.5,93.5 180 top
SV101  53.34,88.9 0 top

### Tracks (layer width: path | path; a pad name or v marks a point on that pad's centre or on a via)
!CPU_BG  (1 unrouted)
!CPU_BR  (1 unrouted)
!CPU_HALT  (1 unrouted)
!CPU_RESET  (2 unrouted)
!MIDI_IRQ  (2 unrouted)
+5V  (42 unrouted)
ADDR_SET0  (1 unrouted)
ADDR_SET1  (1 unrouted)
CPU_A0  (2 unrouted)
CPU_A1  (2 unrouted)
CPU_A2  (2 unrouted)
CPU_A3  (1 unrouted)
CPU_A4  (1 unrouted)
CPU_A5  (1 unrouted)
CPU_A6  (1 unrouted)
CPU_A7  (1 unrouted)
CPU_A8  (1 unrouted)
CPU_A9  (1 unrouted)
CPU_A10  (1 unrouted)
CPU_A11  (1 unrouted)
CPU_A12  (1 unrouted)
CPU_A13  (1 unrouted)
CPU_A14  (1 unrouted)
CPU_A15  (1 unrouted)
CPU_A16  (1 unrouted)
CPU_A17  (1 unrouted)
CPU_A18  (1 unrouted)
CPU_CLK  (1 unrouted)
CPU_D0  (2 unrouted)
CPU_D1  (2 unrouted)
CPU_D2  (2 unrouted)
CPU_D3  (2 unrouted)
CPU_D4  (2 unrouted)
CPU_D5  (2 unrouted)
CPU_D6  (2 unrouted)
CPU_D7  (2 unrouted)
CPU_R/!W!  (2 unrouted)
GND  (via drill 0.35)  (46 unrouted)
  other vias: 159,93.5 159,11 159,13.5 159,8.5 159,16 159,18.5 159,21 159,23.5 159,26 159,31 159,28.5 159,71 159,73.5 159,68.5 159,76 159,78.5 159,81 159,83.5 159,86 159,91 159,88.5 159,63.5 159,66 159,41 159,43.5 159,38.5 159,46 159,48.5 159,51 159,53.5 159,56 159,61 159,58.5 159,33.5 159,36 1,1 143.5,1 141,1 146,1 138.5,1 136,1 133.5,1 131,1 128.5,1 123.5,1 121,1 126,1 118.5,1 116,1 113.5,1 111,1 108.5,1 103.5,1 101,1 106,1 98.5,1 96,1 93.5,1 91,1 88.5,1 83.5,1 81,1 86,1 78.5,1 76,1 73.5,1 71,1 68.5,1 63.5,1 61,1 66,1 58.5,1 56,1 53.5,1 51,1 48.5,1 43.5,1 41,1 46,1 38.5,1 36,1 33.5,1 31,1 28.5,1 23.5,1 21,1 26,1 18.5,1 16,1 13.5,1 11,1 8.5,1 159,1 151,1 148.5,1 1,93.5 1,11 1,13.5 1,8.5 1,16 1,18.5 1,21 1,23.5 1,26 1,31 1,28.5 1,71 1,73.5 1,68.5 1,76 1,78.5 1,81 1,83.5 1,86 1,91 1,88.5 1,63.5 1,66 1,41 1,43.5 1,38.5 1,46 1,48.5 1,51 1,53.5 1,56 1,61 1,58.5 1,33.5 1,36 1,99 143.5,99 141,99 146,99 138.5,99 136,99 133.5,99 131,99 128.5,99 123.5,99 121,99 126,99 118.5,99 116,99 113.5,99 111,99 108.5,99 103.5,99 101,99 106,99 98.5,99 96,99 93.5,99 91,99 88.5,99 83.5,99 81,99 86,99 78.5,99 76,99 73.5,99 71,99 68.5,99 63.5,99 61,99 66,99 58.5,99 56,99 53.5,99 51,99 48.5,99 43.5,99 41,99 46,99 38.5,99 36,99 33.5,99 31,99 28.5,99 23.5,99 21,99 26,99 18.5,99 16,99 13.5,99 11,99 8.5,99 159,99 151,99 148.5,99
  pour Bottom: 0,0 0,100 160,100 160,0
  pour Top: 0,0 0,100 160,100 160,0
LED_APERTURE_BANK  (1 unrouted)
LED_BR  (1 unrouted)
LED_BUS_MBOX_IRQ  (1 unrouted)
LED_CPU_BG  (1 unrouted)
LED_CPU_HALT  (1 unrouted)
LED_CPU_MBOX_IRQ  (1 unrouted)
LED_CPU_RESET  (1 unrouted)
LED_MIDI_IRQ  (1 unrouted)
LED_MIDI_RX  (1 unrouted)
LED_MIDI_TX  (1 unrouted)
LED_YM3812_IRQ  (1 unrouted)
MIDI_RESET  (1 unrouted)
MIDI_RX  (3 unrouted)
MIDI_RX_+  (2 unrouted)
MIDI_RX_-  (2 unrouted)
MIDI_TX  (2 unrouted)
MIDI_TX_-  (1 unrouted)
MIDI_UART_X1  (2 unrouted)
MIDI_UART_X2  (2 unrouted)
N$2  (1 unrouted)
N$4  (1 unrouted)
N$5  (1 unrouted)
N$6  (1 unrouted)
N$7  (1 unrouted)
N$9  (1 unrouted)
N$10  (1 unrouted)
N$11  (1 unrouted)
N$12  (1 unrouted)
N$13  (1 unrouted)
N$14  (1 unrouted)
N$15  (1 unrouted)
N$16  (1 unrouted)
N$17  (1 unrouted)
N$19  (1 unrouted)
N$20  (1 unrouted)
N$21  (1 unrouted)
N$22  (1 unrouted)
N$23  (1 unrouted)
N$24  (1 unrouted)

### Text on the board
tNames: JLCJLCJLCJLC | 68komputer Cacophony Machine™ | 2019 Tristan Seifert | Rev 01